# Altium project nRF-TestDevice.PrjPCB (part 1 of 2)
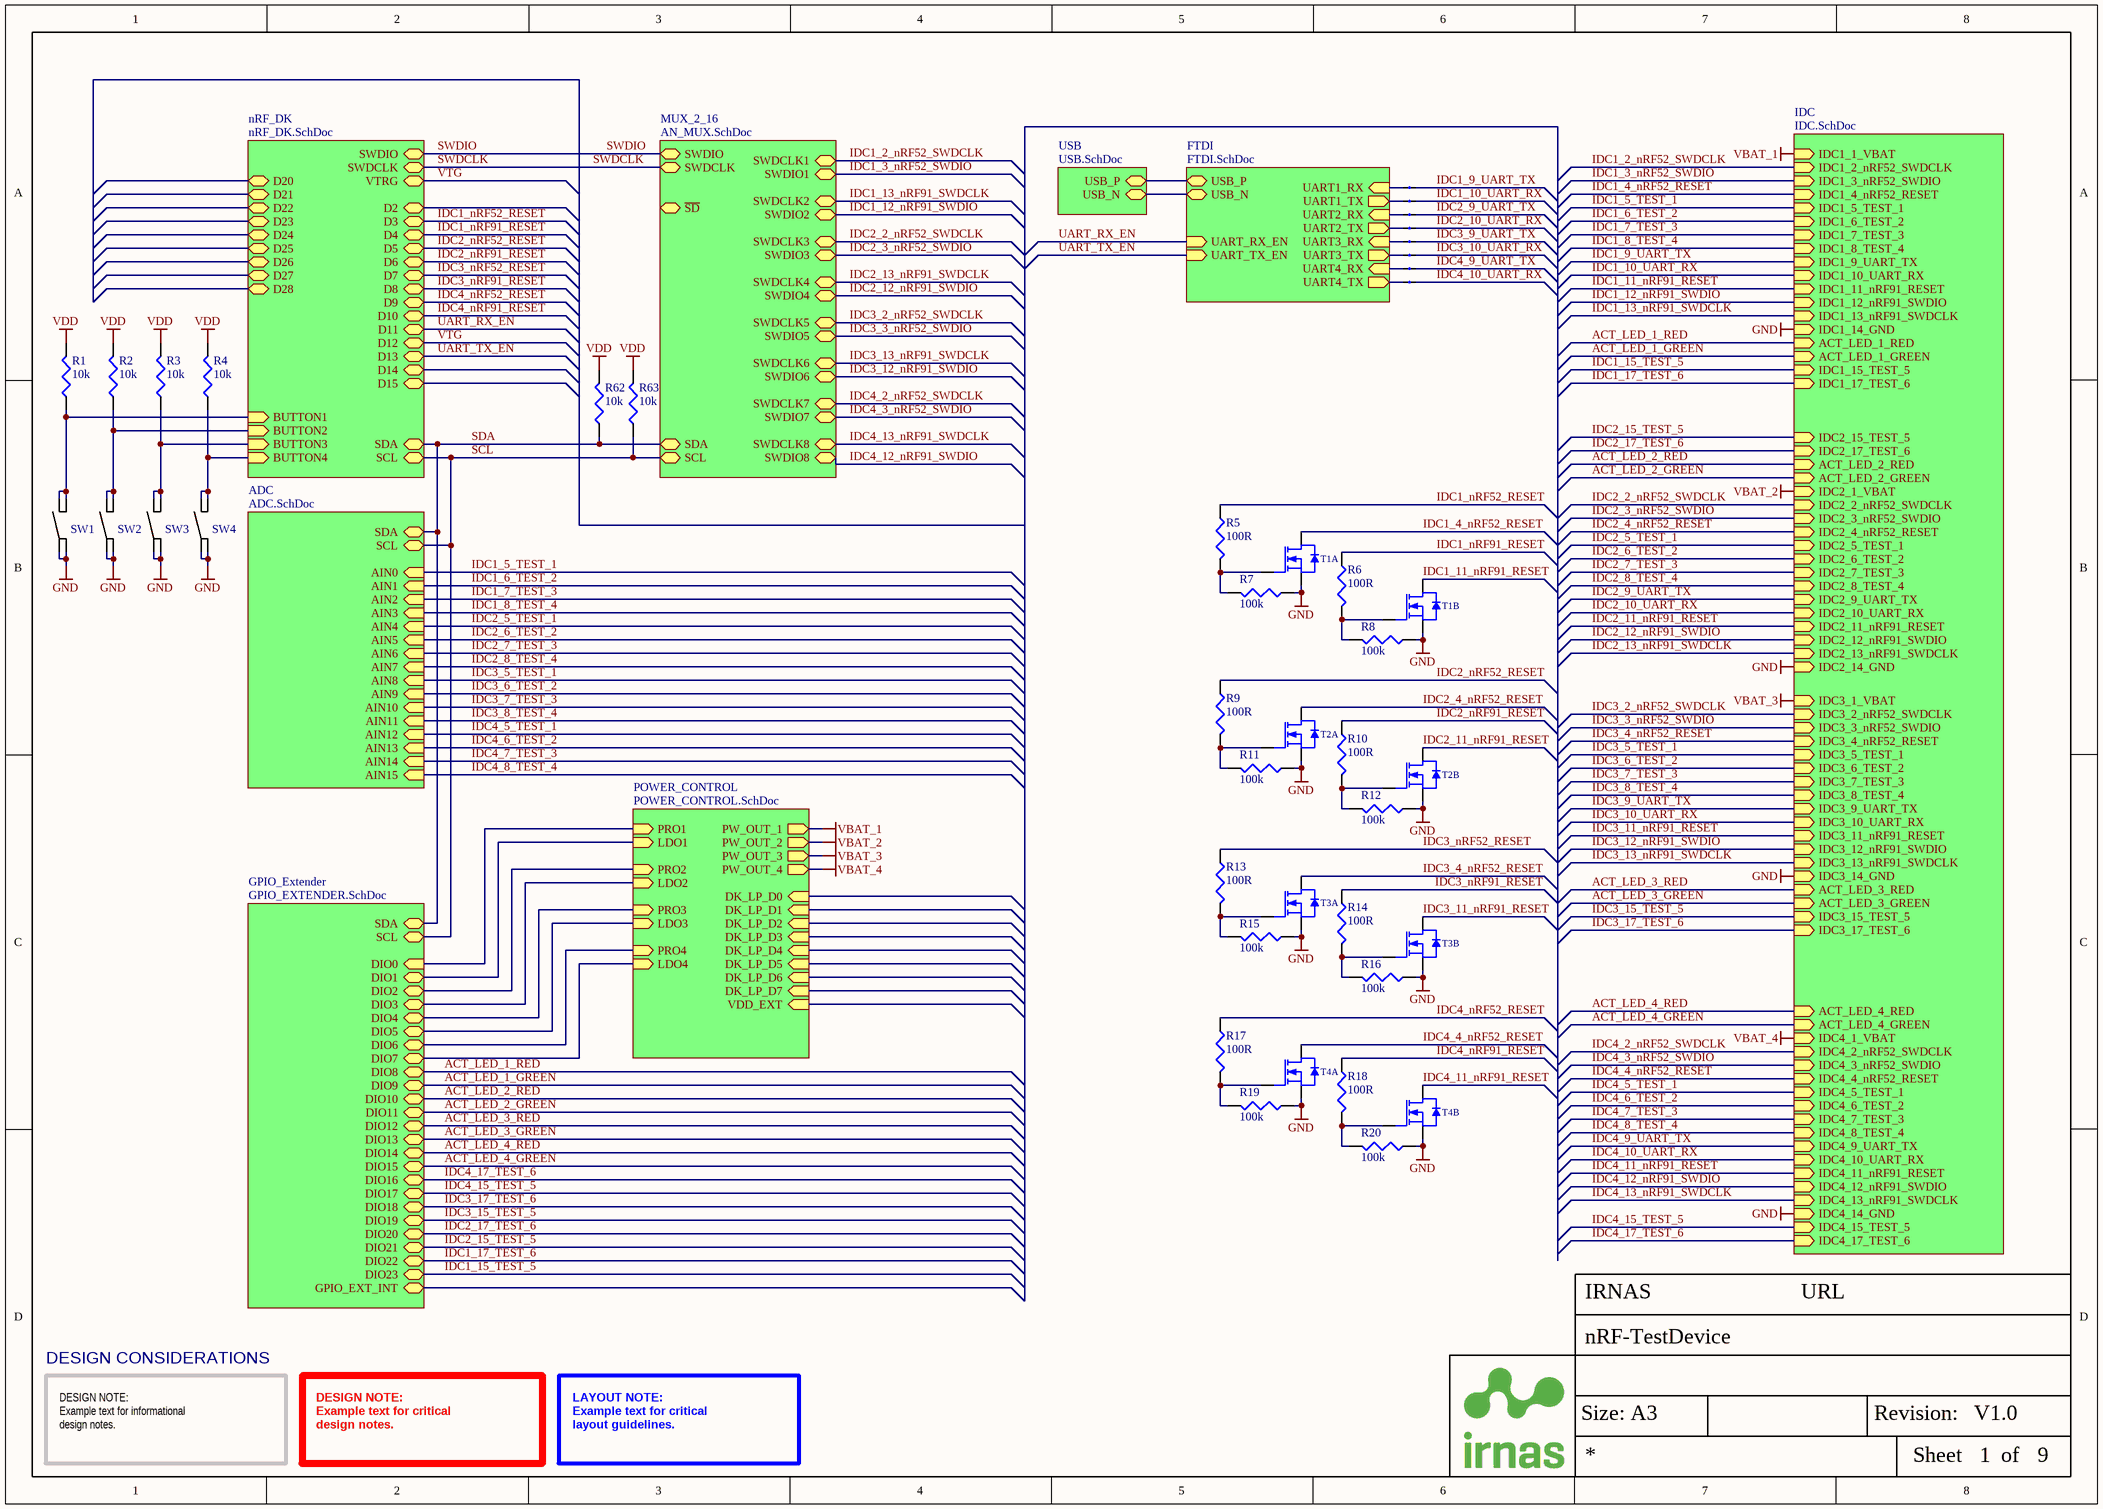
[diagram p0: MAIN.SchDoc]
Company: IRNAS; CreateDate: 11.12.2020; PCBDesigner: Aleksej Cegner; ProjectTitle: nRF-TestDevice; RevisionDate: 24.12.2020; Version: V1.0; Website: URL
9 sheets, 220 parts. Net scope: hierarchical (ports join the sheet entries above them; power ports are global).
Board files: nRF-TestDevice.PcbDoc, nRF-TestDevice_Miror.PcbDoc
Sheets:
  MAIN.SchDoc
    nRF_DK = nRF_DK.SchDoc
    ADC = ADC.SchDoc
    MUX_2_16 = AN_MUX.SchDoc
    GPIO_Extender = GPIO_EXTENDER.SchDoc
    POWER_CONTROL = POWER_CONTROL.SchDoc
    FTDI = FTDI.SchDoc
    IDC = IDC.SchDoc
    USB = USB.SchDoc

## Sheet MAIN.SchDoc
size A3; DocumentNumber: 1; SheetNumber: 1; SheetTotal: 9

### Parts
NT1  (no value)  [2 PIN STARPOINT]  (net tie, no BOM)
NT2  (no value)  [2 PIN STARPOINT]  (net tie, no BOM)
NT3  (no value)  [2 PIN STARPOINT]  (net tie, no BOM)
NT4  (no value)  [2 PIN STARPOINT]  (net tie, no BOM)
NT5  (no value)  [2 PIN STARPOINT]  (net tie, no BOM)
NT6  (no value)  [2 PIN STARPOINT]  (net tie, no BOM)
NT7  (no value)  [2 PIN STARPOINT]  (net tie, no BOM)
NT8  (no value)  [2 PIN STARPOINT]  (net tie, no BOM)
R1  10k  [RES0402]
R2  10k  [RES0402]
R3  10k  [RES0402]
R4  10k  [RES0402]
R5  100R  [RES0402]
R6  100R  [RES0402]
R7  100k  [RES0402]
R8  100k  [RES0402]
R9  100R  [RES0402]
R10  100R  [RES0402]
R11  100k  [RES0402]
R12  100k  [RES0402]
R13  100R  [RES0402]
R14  100R  [RES0402]
R15  100k  [RES0402]
R16  100k  [RES0402]
R17  100R  [RES0402]
R18  100R  [RES0402]
R19  100k  [RES0402]
R20  100k  [RES0402]
R62  10k  [RES0402]
R63  10k  [RES0402]
SW1  PTS645SL50-2 LFS  [Tactile Switch THT]  (value not drawn)
SW2  PTS645SL50-2 LFS  [Tactile Switch THT]  (value not drawn)
SW3  PTS645SL50-2 LFS  [Tactile Switch THT]  (value not drawn)
SW4  PTS645SL50-2 LFS  [Tactile Switch THT]  (value not drawn)
T1  NTZD3154NT1G  [SOT-563]  (value not drawn)  (parts A,B of 2)
T2  NTZD3154NT1G  [SOT-563]  (value not drawn)  (parts A,B of 2)
T3  NTZD3154NT1G  [SOT-563]  (value not drawn)  (parts A,B of 2)
T4  NTZD3154NT1G  [SOT-563]  (value not drawn)  (parts A,B of 2)

### Sub-sheets
ADC = ADC.SchDoc: AIN0 (in), AIN1 (in), AIN2 (in), AIN3 (in), AIN4 (in), AIN5 (in), AIN6 (in), AIN7 (in), SCL (bidir), SDA (bidir), AIN8 (in), AIN9 (in), AIN10 (in), AIN11 (in), AIN12 (in), AIN13 (in), AIN14 (in), AIN15 (in)
FTDI = FTDI.SchDoc: UART1_RX (in), UART1_TX (out), UART2_RX (in), UART2_TX (out), UART3_RX (in), UART3_TX (out), UART4_RX (in), UART4_TX (out), USB_P (bidir), USB_N (bidir), UART_RX_EN (in), UART_TX_EN (in)
GPIO_Extender = GPIO_EXTENDER.SchDoc: DIO1 (bidir), DIO2 (bidir), DIO3 (bidir), DIO4 (bidir), DIO5 (bidir), DIO6 (bidir), DIO7 (bidir), DIO8 (bidir), DIO9 (bidir), DIO10 (bidir), DIO11 (bidir), DIO12 (bidir), DIO13 (bidir), DIO14 (bidir), DIO15 (bidir), SDA (bidir), SCL (bidir), DIO0 (in), DIO17 (bidir), GPIO_EXT_INT (bidir), DIO20 (bidir), DIO22 (bidir), DIO23 (bidir), DIO18 (bidir), DIO16 (bidir), DIO21 (bidir), DIO19 (bidir)
IDC = IDC.SchDoc: IDC1_1_VBAT (in), IDC1_2_nRF52_SWDCLK (in), IDC1_3_nRF52_SWDIO (in), IDC1_4_nRF52_RESET (in), IDC1_5_TEST_1 (in), IDC1_6_TEST_2 (in), IDC1_7_TEST_3 (in), IDC1_8_TEST_4 (in), IDC1_9_UART_TX (in), IDC1_10_UART_RX (in), IDC1_11_nRF91_RESET (in), IDC1_12_nRF91_SWDIO (in), IDC1_13_nRF91_SWDCLK (in), IDC1_14_GND (in), IDC2_1_VBAT (in), IDC2_2_nRF52_SWDCLK (in), IDC2_3_nRF52_SWDIO (in), IDC2_4_nRF52_RESET (in), IDC2_5_TEST_1 (in), IDC2_6_TEST_2 (in), IDC2_7_TEST_3 (in), IDC2_8_TEST_4 (in), IDC2_9_UART_TX (in), IDC2_10_UART_RX (in), IDC2_11_nRF91_RESET (in), IDC2_12_nRF91_SWDIO (in), IDC2_13_nRF91_SWDCLK (in), IDC2_14_GND (in), IDC3_1_VBAT (in), IDC3_2_nRF52_SWDCLK (in), IDC3_3_nRF52_SWDIO (in), IDC3_4_nRF52_RESET (in), IDC3_5_TEST_1 (in), IDC3_6_TEST_2 (in), IDC3_7_TEST_3 (in), IDC3_8_TEST_4 (in), IDC3_9_UART_TX (in), IDC3_10_UART_RX (in), IDC3_11_nRF91_RESET (in), IDC3_12_nRF91_SWDIO (in), IDC3_13_nRF91_SWDCLK (in), IDC3_14_GND (in), IDC4_1_VBAT (in), IDC4_2_nRF52_SWDCLK (in), IDC4_3_nRF52_SWDIO (in), IDC4_4_nRF52_RESET (in), IDC4_5_TEST_1 (in), IDC4_6_TEST_2 (in), IDC4_7_TEST_3 (in), IDC4_8_TEST_4 (in), IDC4_9_UART_TX (in), IDC4_10_UART_RX (in), IDC4_11_nRF91_RESET (in), IDC4_12_nRF91_SWDIO (in), IDC4_13_nRF91_SWDCLK (in), IDC4_14_GND (in), ACT_LED_1_RED (in), ACT_LED_1_GREEN (in), ACT_LED_2_RED (in), ACT_LED_2_GREEN (in), ACT_LED_3_RED (in), ACT_LED_3_GREEN (in), ACT_LED_4_RED (in), ACT_LED_4_GREEN (in), IDC2_17_TEST_6 (in), IDC3_15_TEST_5 (in), IDC3_17_TEST_6 (in), IDC1_17_TEST_6 (in), IDC1_15_TEST_5 (in), IDC4_17_TEST_6 (in), IDC2_15_TEST_5 (in), IDC4_15_TEST_5 (in)
MUX_2_16 = AN_MUX.SchDoc: SWDIO (bidir), SWDCLK (bidir), SWDIO1 (bidir), SWDIO2 (bidir), SWDIO3 (bidir), SWDIO4 (bidir), SWDIO5 (bidir), SWDIO6 (bidir), SWDIO7 (bidir), SWDIO8 (bidir), SWDCLK1 (bidir), SWDCLK2 (bidir), SWDCLK3 (bidir), SWDCLK4 (bidir), SWDCLK5 (bidir), SWDCLK6 (bidir), SWDCLK7 (bidir), SWDCLK8 (bidir), SDA (bidir), SCL (bidir), ~{SD} (bidir)
nRF_DK = nRF_DK.SchDoc: SWDIO (bidir), SWDCLK (bidir), VTRG (bidir), BUTTON1 (in), BUTTON2 (in), BUTTON3 (in), BUTTON4 (in), SDA (bidir), SCL (bidir), D23 (bidir), D25 (bidir), D4 (bidir), D8 (bidir), D15 (bidir), D5 (bidir), D6 (bidir), D21 (bidir), D12 (bidir), D3 (bidir), D27 (bidir), D22 (bidir), D9 (bidir), D11 (bidir), D14 (bidir), D13 (bidir), D2 (bidir), D7 (bidir), D24 (bidir), D26 (bidir), D28 (bidir), D20 (bidir), D10 (bidir)
POWER_CONTROL = POWER_CONTROL.SchDoc: PW_OUT_1 (out), PW_OUT_2 (out), PW_OUT_3 (out), PW_OUT_4 (out), PRO1 (in), LDO1 (in), LDO2 (in), LDO3 (in), LDO4 (in), PRO2 (in), PRO3 (in), PRO4 (in), VDD_EXT (in), DK_LP_D5 (in), DK_LP_D7 (in), DK_LP_D1 (in), DK_LP_D4 (in), DK_LP_D0 (in), DK_LP_D3 (in), DK_LP_D6 (in), DK_LP_D2 (in)
USB = USB.SchDoc: USB_P (bidir), USB_N (bidir)

### Nets
GND: R7.1 R8.1 R11.1 R12.1 R15.1 R16.1 R19.1 R20.1 SW1.1 SW1.2 SW2.1 SW2.2 SW3.1 SW3.2 SW4.1 SW4.2 T1.1(S1) T1.4(S2) T2.1(S1) T2.4(S2) T3.1(S1) T3.4(S2) T4.1(S1) T4.4(S2) ; sheet IDC/IDC1_14_GND, sheet IDC/IDC2_14_GND, sheet IDC/IDC3_14_GND, sheet IDC/IDC4_14_GND
VBAT_1: sheet POWER_CONTROL/PW_OUT_1, sheet IDC/IDC1_1_VBAT
VBAT_2: sheet POWER_CONTROL/PW_OUT_2, sheet IDC/IDC2_1_VBAT
VBAT_3: sheet POWER_CONTROL/PW_OUT_3, sheet IDC/IDC3_1_VBAT
VBAT_4: sheet POWER_CONTROL/PW_OUT_4, sheet IDC/IDC4_1_VBAT
VDD: R1.2 R2.2 R3.2 R4.2 R62.2 R63.2
ACT_LED_1_GREEN: sheet GPIO_Extender/DIO9, sheet IDC/ACT_LED_1_GREEN
ACT_LED_1_RED: sheet GPIO_Extender/DIO8, sheet IDC/ACT_LED_1_RED
ACT_LED_2_GREEN: sheet GPIO_Extender/DIO11, sheet IDC/ACT_LED_2_GREEN
ACT_LED_2_RED: sheet GPIO_Extender/DIO10, sheet IDC/ACT_LED_2_RED
ACT_LED_3_GREEN: sheet GPIO_Extender/DIO13, sheet IDC/ACT_LED_3_GREEN
ACT_LED_3_RED: sheet GPIO_Extender/DIO12, sheet IDC/ACT_LED_3_RED
ACT_LED_4_GREEN: sheet GPIO_Extender/DIO15, sheet IDC/ACT_LED_4_GREEN
ACT_LED_4_RED: sheet GPIO_Extender/DIO14, sheet IDC/ACT_LED_4_RED
DIO0: sheet GPIO_Extender/DIO0, sheet POWER_CONTROL/PRO1
DIO1: sheet GPIO_Extender/DIO1, sheet POWER_CONTROL/LDO1
DIO2: sheet GPIO_Extender/DIO2, sheet POWER_CONTROL/PRO2
DIO3: sheet GPIO_Extender/DIO3, sheet POWER_CONTROL/LDO2
DIO4: sheet GPIO_Extender/DIO4, sheet POWER_CONTROL/PRO3
DIO5: sheet GPIO_Extender/DIO5, sheet POWER_CONTROL/LDO3
DIO6: sheet GPIO_Extender/DIO6, sheet POWER_CONTROL/PRO4
DIO7: sheet GPIO_Extender/DIO7, sheet POWER_CONTROL/LDO4
IDC1_2_nRF52_SWDCLK: sheet MUX_2_16/SWDCLK1, sheet IDC/IDC1_2_nRF52_SWDCLK
IDC1_3_nRF52_SWDIO: sheet MUX_2_16/SWDIO1, sheet IDC/IDC1_3_nRF52_SWDIO
IDC1_4_nRF52_RESET: T1.6(D1) ; sheet IDC/IDC1_4_nRF52_RESET
IDC1_5_TEST_1: sheet ADC/AIN0, sheet IDC/IDC1_5_TEST_1
IDC1_6_TEST_2: sheet ADC/AIN1, sheet IDC/IDC1_6_TEST_2
IDC1_7_TEST_3: sheet ADC/AIN2, sheet IDC/IDC1_7_TEST_3
IDC1_8_TEST_4: sheet ADC/AIN3, sheet IDC/IDC1_8_TEST_4
IDC1_9_UART_TX: NT1.2 ; sheet IDC/IDC1_9_UART_TX
IDC1_10_UART_RX: NT2.2 ; sheet IDC/IDC1_10_UART_RX
IDC1_11_nRF91_RESET: T1.3(D2) ; sheet IDC/IDC1_11_nRF91_RESET
IDC1_12_nRF91_SWDIO: sheet MUX_2_16/SWDIO2, sheet IDC/IDC1_12_nRF91_SWDIO
IDC1_13_nRF91_SWDCLK: sheet MUX_2_16/SWDCLK2, sheet IDC/IDC1_13_nRF91_SWDCLK
IDC1_15_TEST_5: sheet GPIO_Extender/DIO23, sheet IDC/IDC1_15_TEST_5  [project net DIO23]
IDC1_17_TEST_6: sheet GPIO_Extender/DIO22, sheet IDC/IDC1_17_TEST_6  [project net DIO22]
IDC1_nRF52_RESET: R5.1 ; sheet nRF_DK/D3
IDC1_nRF91_RESET: R6.1 ; sheet nRF_DK/D4
IDC2_2_nRF52_SWDCLK: sheet MUX_2_16/SWDCLK3, sheet IDC/IDC2_2_nRF52_SWDCLK
IDC2_3_nRF52_SWDIO: sheet MUX_2_16/SWDIO3, sheet IDC/IDC2_3_nRF52_SWDIO
IDC2_4_nRF52_RESET: T2.6(D1) ; sheet IDC/IDC2_4_nRF52_RESET
IDC2_5_TEST_1: sheet ADC/AIN4, sheet IDC/IDC2_5_TEST_1
IDC2_6_TEST_2: sheet ADC/AIN5, sheet IDC/IDC2_6_TEST_2
IDC2_7_TEST_3: sheet ADC/AIN6, sheet IDC/IDC2_7_TEST_3
IDC2_8_TEST_4: sheet ADC/AIN7, sheet IDC/IDC2_8_TEST_4
IDC2_9_UART_TX: NT3.2 ; sheet IDC/IDC2_9_UART_TX
IDC2_10_UART_RX: NT4.2 ; sheet IDC/IDC2_10_UART_RX
IDC2_11_nRF91_RESET: T2.3(D2) ; sheet IDC/IDC2_11_nRF91_RESET
IDC2_12_nRF91_SWDIO: sheet MUX_2_16/SWDIO4, sheet IDC/IDC2_12_nRF91_SWDIO
IDC2_13_nRF91_SWDCLK: sheet MUX_2_16/SWDCLK4, sheet IDC/IDC2_13_nRF91_SWDCLK
IDC2_15_TEST_5: sheet GPIO_Extender/DIO21, sheet IDC/IDC2_15_TEST_5  [project net DIO21]
IDC2_17_TEST_6: sheet GPIO_Extender/DIO20, sheet IDC/IDC2_17_TEST_6  [project net DIO20]
IDC2_nRF52_RESET: R9.1 ; sheet nRF_DK/D5
IDC2_nRF91_RESET: R10.1 ; sheet nRF_DK/D6
IDC3_2_nRF52_SWDCLK: sheet MUX_2_16/SWDCLK5, sheet IDC/IDC3_2_nRF52_SWDCLK
IDC3_3_nRF52_SWDIO: sheet MUX_2_16/SWDIO5, sheet IDC/IDC3_3_nRF52_SWDIO
IDC3_4_nRF52_RESET: T3.6(D1) ; sheet IDC/IDC3_4_nRF52_RESET
IDC3_5_TEST_1: sheet ADC/AIN8, sheet IDC/IDC3_5_TEST_1
IDC3_6_TEST_2: sheet ADC/AIN9, sheet IDC/IDC3_6_TEST_2
IDC3_7_TEST_3: sheet ADC/AIN10, sheet IDC/IDC3_7_TEST_3
IDC3_8_TEST_4: sheet ADC/AIN11, sheet IDC/IDC3_8_TEST_4
IDC3_9_UART_TX: NT5.2 ; sheet IDC/IDC3_9_UART_TX
IDC3_10_UART_RX: NT6.2 ; sheet IDC/IDC3_10_UART_RX
IDC3_11_nRF91_RESET: T3.3(D2) ; sheet IDC/IDC3_11_nRF91_RESET
IDC3_12_nRF91_SWDIO: sheet MUX_2_16/SWDIO6, sheet IDC/IDC3_12_nRF91_SWDIO
IDC3_13_nRF91_SWDCLK: sheet MUX_2_16/SWDCLK6, sheet IDC/IDC3_13_nRF91_SWDCLK
IDC3_15_TEST_5: sheet GPIO_Extender/DIO19, sheet IDC/IDC3_15_TEST_5  [project net DIO19]
IDC3_17_TEST_6: sheet GPIO_Extender/DIO18, sheet IDC/IDC3_17_TEST_6  [project net DIO18]
IDC3_nRF52_RESET: R13.1 ; sheet nRF_DK/D7
IDC3_nRF91_RESET: R14.1 ; sheet nRF_DK/D8
IDC4_2_nRF52_SWDCLK: sheet MUX_2_16/SWDCLK7, sheet IDC/IDC4_2_nRF52_SWDCLK
IDC4_3_nRF52_SWDIO: sheet MUX_2_16/SWDIO7, sheet IDC/IDC4_3_nRF52_SWDIO
IDC4_4_nRF52_RESET: T4.6(D1) ; sheet IDC/IDC4_4_nRF52_RESET
IDC4_5_TEST_1: sheet ADC/AIN12, sheet IDC/IDC4_5_TEST_1
IDC4_6_TEST_2: sheet ADC/AIN13, sheet IDC/IDC4_6_TEST_2
IDC4_7_TEST_3: sheet ADC/AIN14, sheet IDC/IDC4_7_TEST_3
IDC4_8_TEST_4: sheet ADC/AIN15, sheet IDC/IDC4_8_TEST_4
IDC4_9_UART_TX: NT7.2 ; sheet IDC/IDC4_9_UART_TX
IDC4_10_UART_RX: NT8.2 ; sheet IDC/IDC4_10_UART_RX
IDC4_11_nRF91_RESET: T4.3(D2) ; sheet IDC/IDC4_11_nRF91_RESET
IDC4_12_nRF91_SWDIO: sheet MUX_2_16/SWDIO8, sheet IDC/IDC4_12_nRF91_SWDIO
IDC4_13_nRF91_SWDCLK: sheet MUX_2_16/SWDCLK8, sheet IDC/IDC4_13_nRF91_SWDCLK
IDC4_15_TEST_5: sheet GPIO_Extender/DIO17, sheet IDC/IDC4_15_TEST_5  [project net DIO17]
IDC4_17_TEST_6: sheet GPIO_Extender/DIO16, sheet IDC/IDC4_17_TEST_6  [project net DIO16]
IDC4_nRF52_RESET: R17.1 ; sheet nRF_DK/D9
IDC4_nRF91_RESET: R18.1 ; sheet nRF_DK/D10
P0.16: R1.1 SW1.3 SW1.4 ; sheet nRF_DK/BUTTON1
P0.17: R2.1 SW2.3 SW2.4 ; sheet nRF_DK/BUTTON2
P0.18: R3.1 SW3.3 SW3.4 ; sheet nRF_DK/BUTTON3
P0.19: R4.1 SW4.3 SW4.4 ; sheet nRF_DK/BUTTON4
SCL: R63.1 ; sheet nRF_DK/SCL, sheet ADC/SCL, sheet MUX_2_16/SCL, sheet GPIO_Extender/SCL  [project net P0.31]
SDA: R62.1 ; sheet nRF_DK/SDA, sheet ADC/SDA, sheet MUX_2_16/SDA, sheet GPIO_Extender/SDA  [project net P0.30]
SWDCLK: sheet nRF_DK/SWDCLK, sheet MUX_2_16/SWDCLK
SWDIO: sheet nRF_DK/SWDIO, sheet MUX_2_16/SWDIO
UART1_RX: NT1.1 ; sheet FTDI/UART1_RX
UART1_TX: NT2.1 ; sheet FTDI/UART1_TX
UART2_RX: NT3.1 ; sheet FTDI/UART2_RX
UART2_TX: NT4.1 ; sheet FTDI/UART2_TX
UART3_RX: NT5.1 ; sheet FTDI/UART3_RX
UART3_TX: NT6.1 ; sheet FTDI/UART3_TX
UART4_RX: NT7.1 ; sheet FTDI/UART4_RX
UART4_TX: NT8.1 ; sheet FTDI/UART4_TX
UART_RX_EN: sheet nRF_DK/D11, sheet nRF_DK/D13, sheet FTDI/UART_RX_EN, sheet FTDI/UART_TX_EN  [also labelled UART_TX_EN]  [project net P0.11]
USB_N: sheet FTDI/USB_N, sheet USB/USB_N
USB_P: sheet FTDI/USB_P, sheet USB/USB_P
VTG: sheet nRF_DK/VTRG, sheet nRF_DK/D12  [project net P0.12]
NetR5_2: R5.2 R7.2 T1.2(G1)
NetR6_2: R6.2 R8.2 T1.5(G2)
NetR9_2: R9.2 R11.2 T2.2(G1)
NetR10_2: R10.2 R12.2 T2.5(G2)
NetR13_2: R13.2 R15.2 T3.2(G1)
NetR14_2: R14.2 R16.2 T3.5(G2)
NetR17_2: R17.2 R19.2 T4.2(G1)
NetR18_2: R18.2 R20.2 T4.5(G2)

### Notes on the sheet
- DESIGN CONSIDERATIONS
- DESIGN NOTE:
  Example text for informational
  design notes.
- DESIGN NOTE:
  Example text for critical
  design notes.
- LAYOUT NOTE:
  Example text for critical
  layout guidelines.
- Size: A3
- Revision:
- Sheet
- of

### Library data of the parts
NT1-NT8 = NetTie: Starpoint
R1-R4 R62 R63 = R - 10k/0402: MULTICOMP         MCWR04X1002FTL             SMD Chip Resistor, Thick Film, 10 kohm, 50 V, 0402 [1005 Metric], 62.5 mW,  1%, MCWR Series; IRNAS Part No.: I-100014; Resistance: 10kR; Voltage Rating: 50V; Power Rating: 62.5mW; Temperature Coefficient: 100ppm/°C; Supplier 1: Farnell; Manufacturer: Multicomp; Manufacturer Part Number: MCWR04X1002FTL; Stock 1: 602609; Pricing 1: 10=0.0029, 100=0.0017, 500=0.0012, 2500=0.001, 5000=0.0008 (EUR); Case/Package: 0402; Case Code (Metric): 1005; Case Code (Imperial): 0402; Packaging: Cut Tape; Composition: Thick Film; Tolerance: 1%; Voltage Rating (DC): 50V; REACH SVHC: No SVHC; ComponentLink1URL: http://www.farnell.com/datasheets/1849611.pdf; ComponentLink1Description: http://www.farnell.com/datasheets/1849611.pdf; Supplier Part Number 1: 2447096
R5 R6 R9 R10 R13 R14 R17 R18 = R - 100R/0402: MULTICOMP         MCMR04X1000FTL            SMD Chip Resistor, Ceramic, MCMR Series, 100 ohm, 50 V, 0402 [1005 Metric], 62.5 mW,  1%; IRNAS Part No.: /; Temperature Coefficient: 100ppm/°C; Power Rating: 62.5mW; Voltage Rating: 50V; Supplier 1: Farnell; Manufacturer: Multicomp; Manufacturer Part Number: MCMR04X1000FTL; Stock 1: 62365; Pricing 1: 10=0.0071, 100=0.0042, 500=0.003, 2500=0.0024, 5000=0.0019 (GBP); Case/Package: 0402; Case Code (Metric): 1005; Case Code (Imperial): 0402; Resistance: 100R; Tolerance: 1%; Composition: Ceramic; Packaging: Cut Tape; Voltage Rating (DC): 50V; REACH SVHC: No SVHC; ComponentLink1URL: https://datasheet.ciiva.com/28692/1716705-28692087.pdf; ComponentLink1Description: https://datasheet.ciiva.com/28692/1716705-28692087.pdf; ComponentLink2URL: https://datasheet.ciiva.com/22708/1716705-22708156.pdf; ComponentLink2Description: https://datasheet.ciiva.com/22708/1716705-22708156.pdf; Supplier Part Number 1: 2072515
R7 R8 R11 R12 R15 R16 R19 R20 = R - 100k/0402: MULTICOMP   MCWR04X1003FTL   RES, THICK FILM, 100KOHM, 1%, 0.0625W; IRNAS Part No.: I-100013; Resistance: 100kR; Power Rating: 62.5mW; Voltage Rating: 50V; Temperature Coefficient: 100ppm/°C; Supplier 1: Farnell; Manufacturer: Multicomp; Manufacturer Part Number: MCWR04X1003FTL; Stock 1: 161188; Pricing 1: 10=0.0029, 100=0.0017, 500=0.0012, 2500=0.001, 5000=0.0008 (EUR); Mount: Surface Mount; Case/Package: 0402; Case Code (Metric): 1005; Case Code (Imperial): 0402; Tolerance: 1%; Packaging: Cut Tape; Composition: Thick Film; Voltage Rating (DC): 50V; REACH SVHC: No SVHC; ComponentLink1URL: https://datasheet.ciiva.com/46386/1849611-46386524.pdf; ComponentLink1Description: https://datasheet.ciiva.com/46386/1849611-46386524.pdf; Supplier Part Number 1: 2447094
SW1-SW4 = SW - PTS645SL50-2 LFS: Tactile Switch, PT645 Series, Top Actuated, Through Hole, Round Button, 130 gf, 50mA at 12VDC; Manufacturer: C&K; Number of Circuits: 3; Max Voltage Rating (DC): 24V; Throw Configuration: SPST; Insulation Resistance: 100MR; Manufacturer Part Number: PTS645SL50-2 LFS; Stock 1: 20221; Pricing 1: 5 = 1.32000, 25 = 1.07000, 100 = 0.76000, 150 = 0.68000, 250 = 0.60600, 1000 = 0.51000 (EUR); RoHS: Yes; REACH SVHC: Unknown; Flammability Rating: UL94 V-0; ComponentLink1URL: http://www.farnell.com/datasheets/2789831.pdf?_ga=2.4891187.1885680894.1564390817-1373726713.1554121096&_gac=1.58261848.1562763802.CjwKCAjwmZbpBRAGEiwADrmVXm8xT8OHDZvJe8qZIQyyGmIuiUD-TEITatw0hIdDkyBwIXXCH7oneRoCl7cQAvD_BwE; ComponentLink1Description: Datasheet; Supplier 1: Farnell; Supplier Part Number 1: 2435162
T1-T4 = T_M - NTZD3154NT1G: Dual MOSFET, Dual N Channel, 540 mA, 20 V, 0.4 ohm, 4.5 V, 1 V; ELRAD Id sifra / ELRAD Id No: 597778; Opis / Description: MOSFET BSS123       /N-Channel; Komp / Device: SMD; Value: BSS123; Velikost / Size: SOT23; FIT: 0.44; Author: Ciril Golob; Date: 11.07.2018; ComponentLINK1Description: Datasheet; ComponentLINK2Description: Datasheet www; ComponentLINK1URL: c:\ELRADSVN\Altium_Library\Libraries\Active\Datasheet\BSS123.pdf; ComponentLINK2URL: http://www.onsemi.com/pub/Collateral/BSS123-D.PDF

## Sheet nRF_DK.SchDoc
size A3; DocumentNumber: 2; SheetNumber: 2; SheetTotal: 9
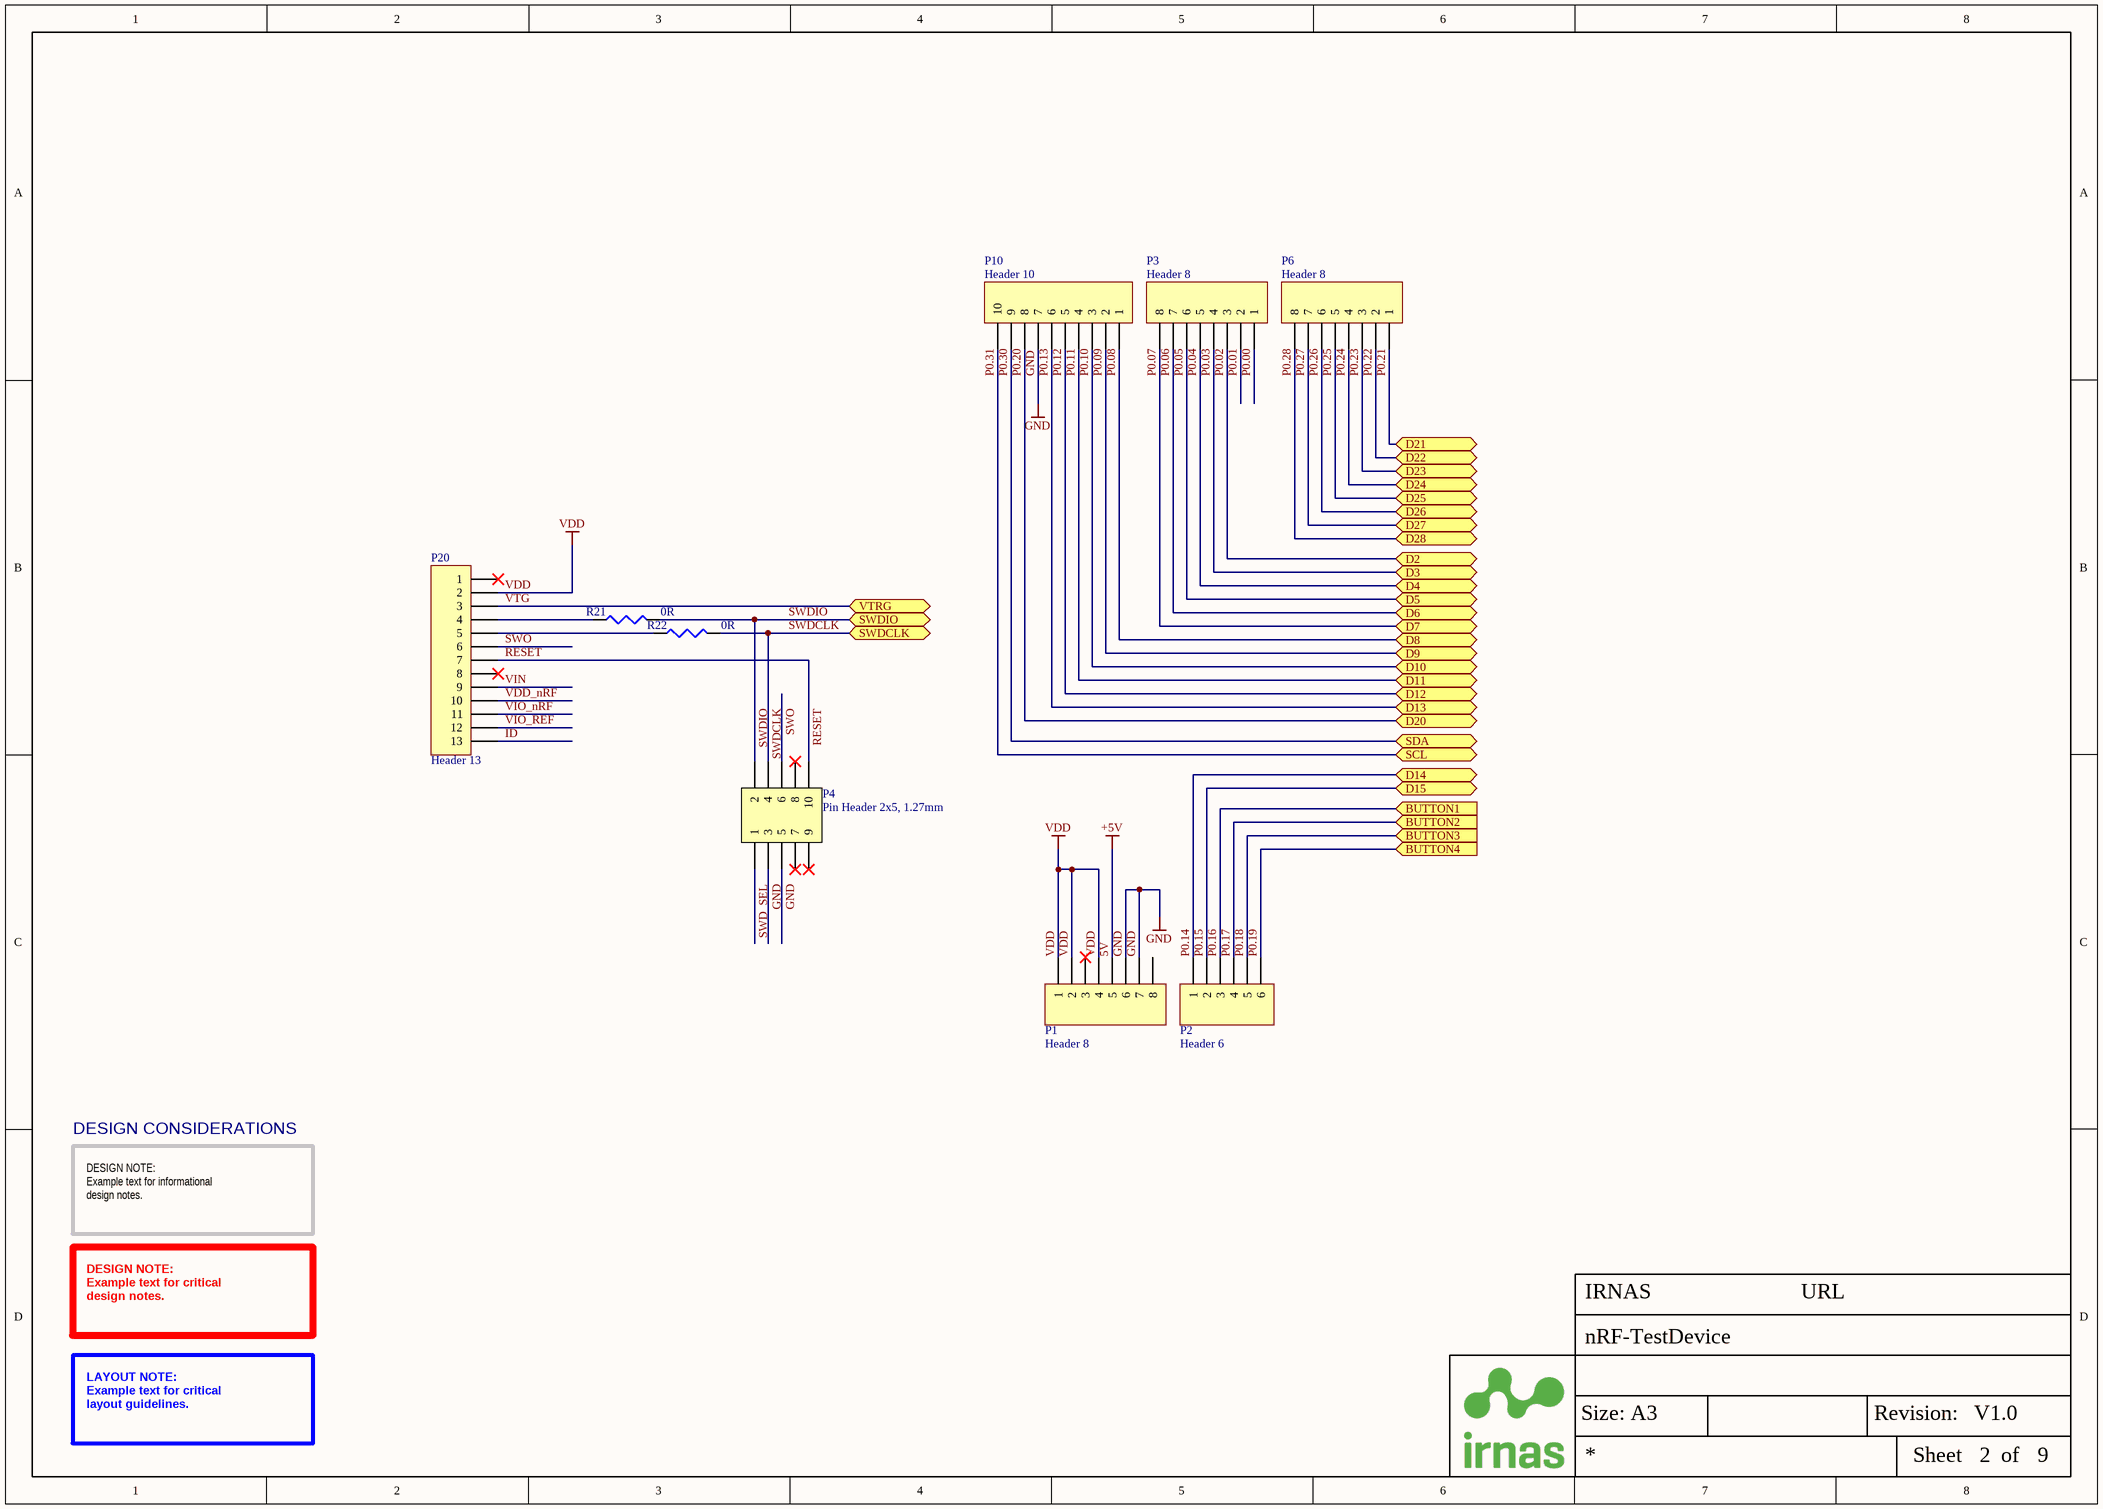
[diagram p1: nRF_DK.SchDoc]

### Parts
P1  Header 8  [HDR1X8]
P2  Header 6  [HDR1X6]
P3  Header 8  [HDR1X8]
P4  Pin Header 2x5, 1.27mm  [HDR_2x5-SMD-1.27mm-K]
P6  Header 8  [HDR1X8]
P10  Header 10  [HDR1X10]
P20  Header 13  [HDR1X13]
R21  0R  [RES0402]
R22  0R  [RES0402]

### Ports
BUTTON1 (in), BUTTON2 (in), BUTTON3 (in), BUTTON4 (in), D2 (bidir), D3 (bidir), D4 (bidir), D5 (bidir), D6 (bidir), D7 (bidir), D8 (bidir), D9 (bidir), D10 (bidir), D11 (bidir), D12 (bidir), D13 (bidir), D14 (bidir), D15 (bidir), D20 (bidir), D21 (bidir), D22 (bidir), D23 (bidir), D24 (bidir), D25 (bidir), D26 (bidir), D27 (bidir), D28 (bidir), SCL (bidir), SDA (bidir), SWDCLK (bidir), SWDIO (bidir), VTRG (bidir)

### Nets
5V: P1.5  [also labelled +5V]
GND: P1.6 P1.7 P4.3 P4.5 P10.7
VDD: P1.1 P1.2 P1.4 P20.2
ID: P20.13
P0.00: P3.1
P0.01: P3.2
P0.02: P3.3 ; port D2
P0.03: P3.4 ; port D3  [project net IDC1_nRF52_RESET]
P0.04: P3.5 ; port D4  [project net IDC1_nRF91_RESET]
P0.05: P3.6 ; port D5  [project net IDC2_nRF52_RESET]
P0.06: P3.7 ; port D6  [project net IDC2_nRF91_RESET]
P0.07: P3.8 ; port D7  [project net IDC3_nRF52_RESET]
P0.08: P10.1 ; port D8  [project net IDC3_nRF91_RESET]
P0.09: P10.2 ; port D9  [project net IDC4_nRF52_RESET]
P0.10: P10.3 ; port D10  [project net IDC4_nRF91_RESET]
P0.11: P10.4 P10.6 ; port D11, port D13  [also labelled P0.13]
P0.12: P10.5 P20.3 ; port VTRG, port D12  [also labelled VTG]
P0.14: P2.1 ; port D14
P0.15: P2.2 ; port D15
P0.16: P2.3 ; port BUTTON1
P0.17: P2.4 ; port BUTTON2
P0.18: P2.5 ; port BUTTON3
P0.19: P2.6 ; port BUTTON4
P0.20: P10.8 ; port D20
P0.21: P6.1 ; port D21
P0.22: P6.2 ; port D22
P0.23: P6.3 ; port D23
P0.24: P6.4 ; port D24
P0.25: P6.5 ; port D25
P0.26: P6.6 ; port D26
P0.27: P6.7 ; port D27
P0.28: P6.8 ; port D28
P0.30: P10.9 ; port SDA
P0.31: P10.10 ; port SCL
RESET: P4.10 P20.7
SWD_SEL: P4.1
SWDCLK: P4.4 R22.2 ; port SWDCLK
SWDIO: P4.2 R21.2 ; port SWDIO
SWO: P4.6 P20.6
VDD_nRF: P20.10
VIN: P20.9
VIO_nRF: P20.11
VIO_REF: P20.12
NetP20_4: P20.4 R21.1
NetP20_5: P20.5 R22.1

Not connected (* = marked no-connect by the designer): P1 3* 8; P4 7* 8* 9*; P20 1* 8*

### Notes on the sheet
- DESIGN CONSIDERATIONS
- DESIGN NOTE:
  Example text for informational
  design notes.
- DESIGN NOTE:
  Example text for critical
  design notes.
- LAYOUT NOTE:
  Example text for critical
  layout guidelines.
- Size: A3
- Revision:
- Sheet
- of

### Library data of the parts
P1 P3 P6 = Header 8: Header, 8-Pin; LatestRevisionDate: 17-Jul-2002; LatestRevisionNote: Re-released for DXP Platform.; Publisher: Altium Limited
P2 = Header 6: Header, 6-Pin; LatestRevisionDate: 17-Jul-2002; LatestRevisionNote: Re-released for DXP Platform.; Publisher: Altium Limited
P4 = CONN-2x5: Pin Header 2x5, 1.27mm (50mil), SMD, Keying Shroud; Part Number: Pin Header 2x5 SMD, 1.27mm, KS; Manufacturer: W-CON; Manufacturer Part Number: 3132-10MS0BK00R1; Part number IPS: 00000009968; Artikkelnr Noca: 55010009; Footprint Doc: HDR_2x5-SMD-1.27mm; LatestRevisionDate: 2016-04-21; Pin Count: 10; Publisher: Nordic Semiconductor; Published: 2016-01-22; Value: Pin Header 2x5, 1.27mm; Note: *; ComponentLink1URL: *; ComponentLink1Description: Datasheet; ComponentLink2URL: *; ComponentLink2Description: Supplier link; HelpURL: \\hizz\pro\app9717\Datasheet\connectores\W-CON\3132-XXMXXBK00XX.pdf; Supplier 1: Cabcon; Supplier Part Number 1: 3132-10MS0BK00R1; Supplier 2: Samtec; Supplier Part Number 2: FTSH-105-01-F-DV-K
P10 = Header 10: Header, 10-Pin; LatestRevisionDate: 17-Jul-2002; LatestRevisionNote: Re-released for DXP Platform.; Publisher: Altium Limited
P20 = Header 13: Header, 13-Pin; LatestRevisionDate: 17-Jul-2002; LatestRevisionNote: Re-released for DXP Platform.; Publisher: Altium Limited
R21 R22 = R - 0R/0402: RESISTOR, 0402, 0R, ANTI SULFURATION; Manufacturer: Multicomp; Manufacturer Part Number: MCMR04X000PTL; IRNAS Part No.: I-100016; Voltage Rating: 50V; Resistance: 0mR; Power Rating: 62.5mW; Temperature Coefficient: 400ppm/°C; Supplier 1: Farnell; Stock 1: 0; Pricing 1: 10=0.0057, 100=0.0034, 500=0.0024, 2500=0.0019, 5000=0.0015 (EUR); Case/Package: 0402; Case Code (Metric): 1005; Case Code (Imperial): 0402; Packaging: Cut Tape; Composition: Ceramic; Voltage Rating (DC): 50V; REACH SVHC: No SVHC; ComponentLink1URL: https://datasheet.ciiva.com/7776/1716705-7776974.pdf; ComponentLink1Description: https://datasheet.ciiva.com/7776/1716705-7776974.pdf; ComponentLink2URL: https://datasheet.ciiva.com/28677/1716705-28677161.pdf; ComponentLink2Description: https://datasheet.ciiva.com/28677/1716705-28677161.pdf; Supplier Part Number 1: 2072513

## Sheet ADC.SchDoc
size A3; DocumentNumber: 6; SheetNumber: 6; SheetTotal: 9
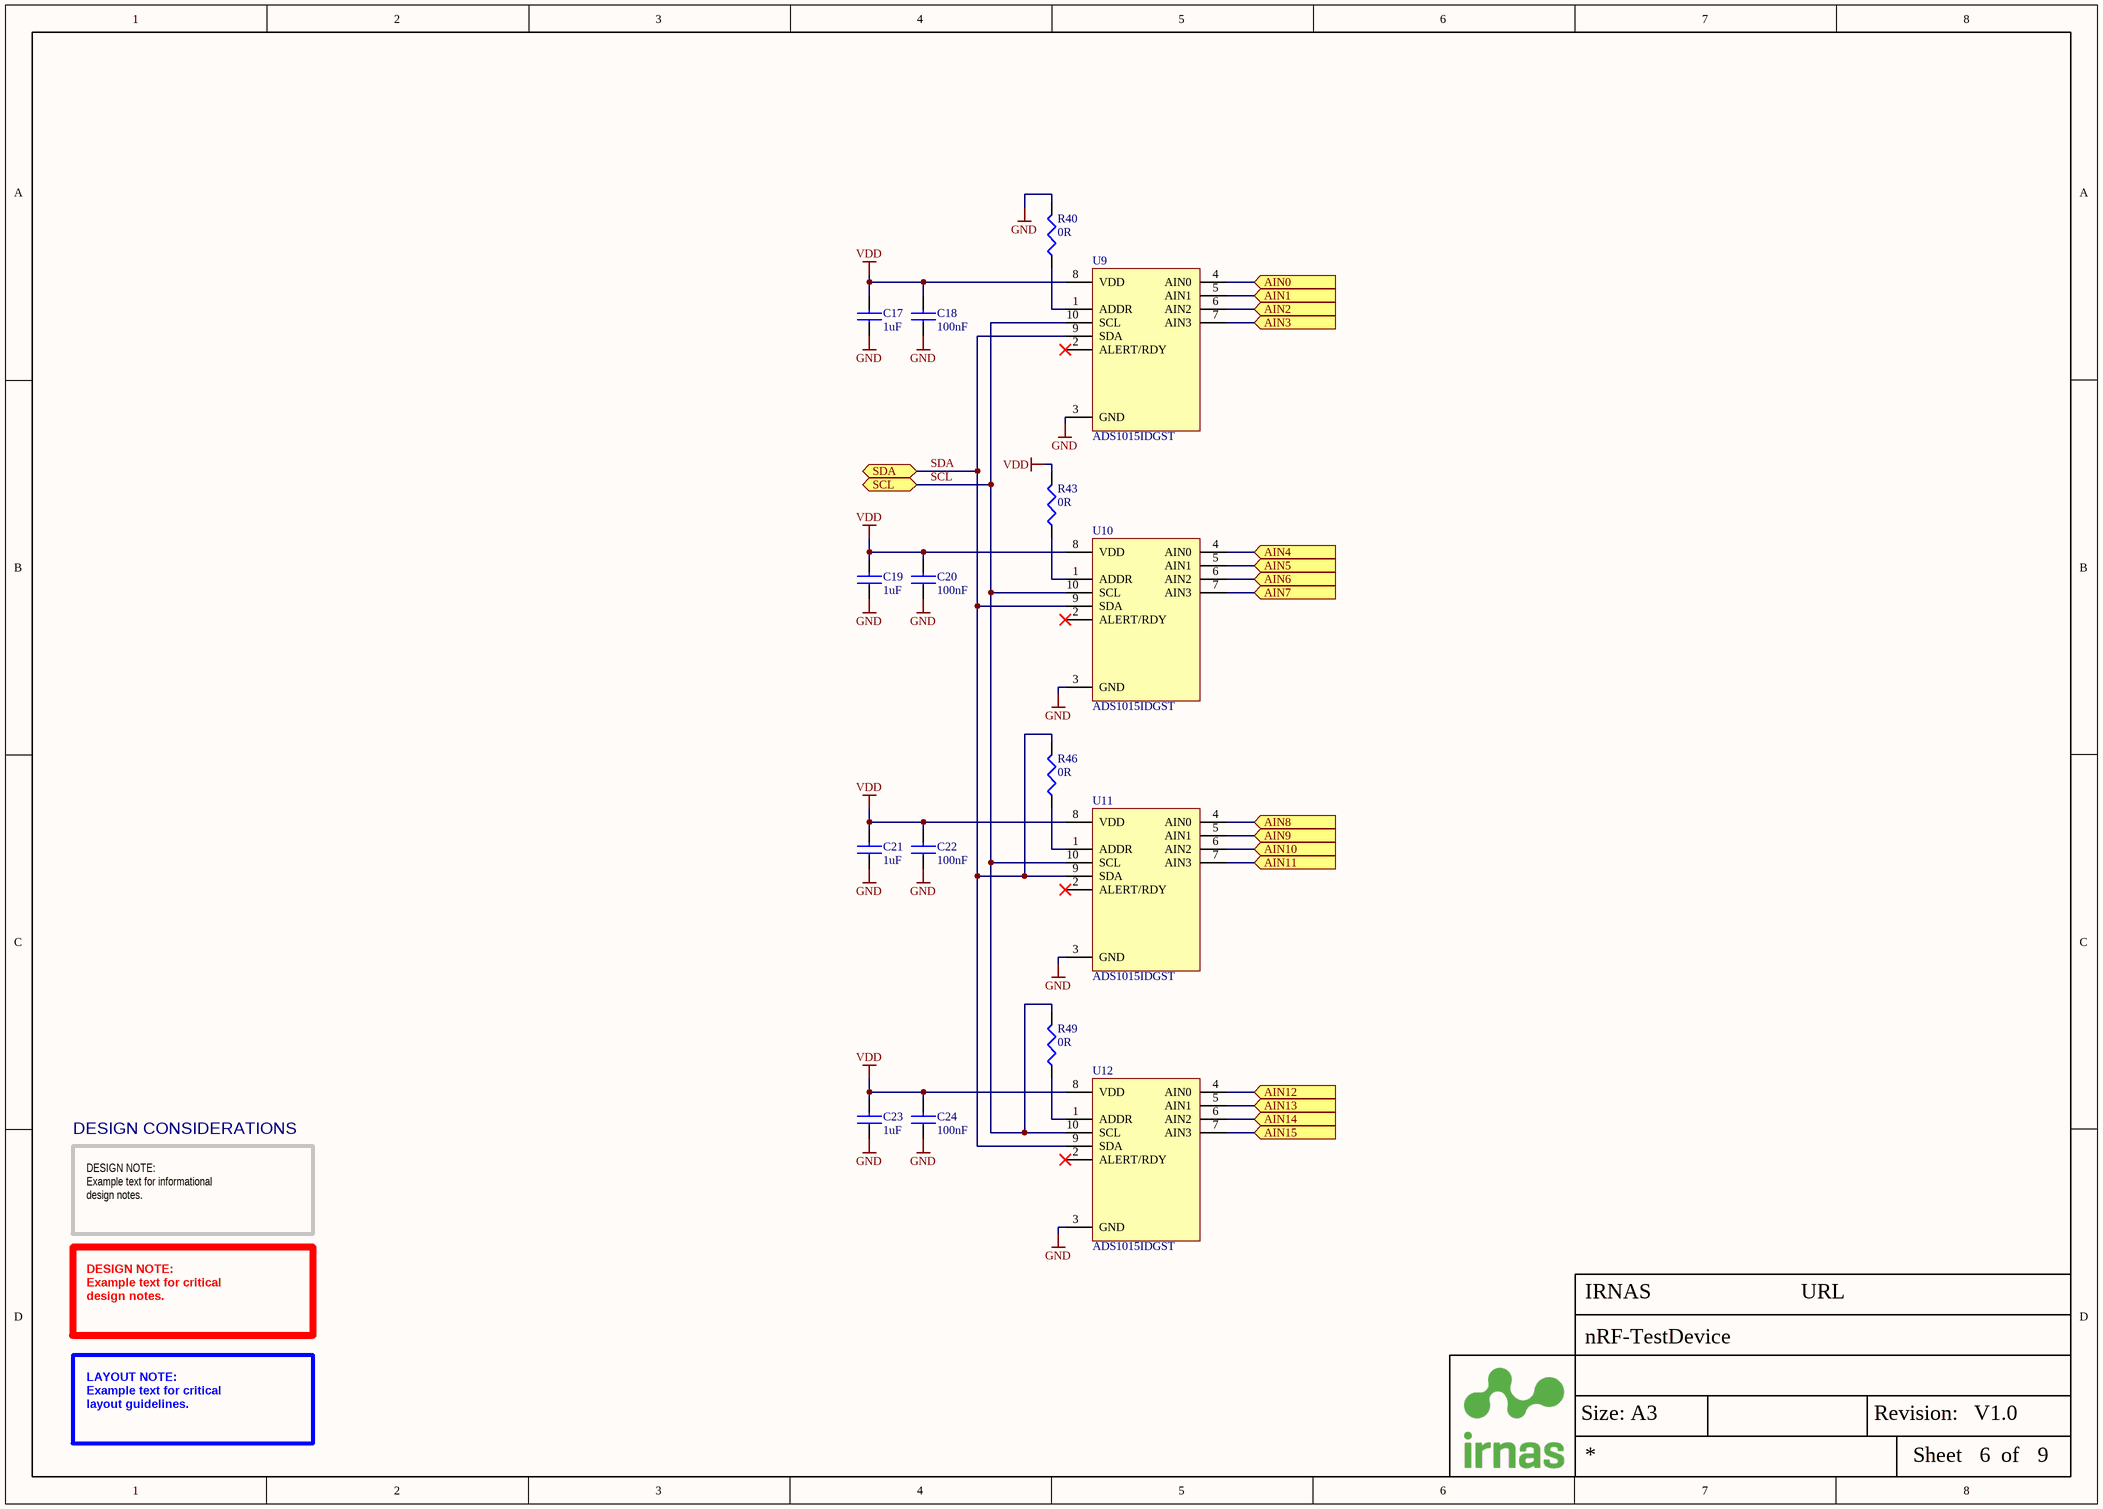
[diagram p2: ADC.SchDoc]

### Parts
C17  1uF  [CAP0402]
C18  100nF  [CAP0402]
C19  1uF  [CAP0402]
C20  100nF  [CAP0402]
C21  1uF  [CAP0402]
C22  100nF  [CAP0402]
C23  1uF  [CAP0402]
C24  100nF  [CAP0402]
R40  0R  [RES0402]
R43  0R  [RES0402]
R46  0R  [RES0402]
R49  0R  [RES0402]
U9  ADS1015IDGST  [VSSOP-10]
U10  ADS1015IDGST  [VSSOP-10]
U11  ADS1015IDGST  [VSSOP-10]
U12  ADS1015IDGST  [VSSOP-10]

### Ports
AIN0 (in), AIN1 (in), AIN2 (in), AIN3 (in), AIN4 (in), AIN5 (in), AIN6 (in), AIN7 (in), AIN8 (in), AIN9 (in), AIN10 (in), AIN11 (in), AIN12 (in), AIN13 (in), AIN14 (in), AIN15 (in), SCL (bidir), SDA (bidir)

### Nets
GND: C17.1 C18.1 C19.1 C20.1 C21.1 C22.1 C23.1 C24.1 R40.2 U9.3(GND) U10.3(GND) U11.3(GND) U12.3(GND)
VDD: C17.2 C18.2 C19.2 C20.2 C21.2 C22.2 C23.2 C24.2 R43.2 U9.8(VDD) U10.8(VDD) U11.8(VDD) U12.8(VDD)
IDC1_5_TEST_1: U9.4(AIN0) ; port AIN0
IDC1_6_TEST_2: U9.5(AIN1) ; port AIN1
IDC1_7_TEST_3: U9.6(AIN2) ; port AIN2
IDC1_8_TEST_4: U9.7(AIN3) ; port AIN3
IDC2_5_TEST_1: U10.4(AIN0) ; port AIN4
IDC2_6_TEST_2: U10.5(AIN1) ; port AIN5
IDC2_7_TEST_3: U10.6(AIN2) ; port AIN6
IDC2_8_TEST_4: U10.7(AIN3) ; port AIN7
IDC3_5_TEST_1: U11.4(AIN0) ; port AIN8
IDC3_6_TEST_2: U11.5(AIN1) ; port AIN9
IDC3_7_TEST_3: U11.6(AIN2) ; port AIN10
IDC3_8_TEST_4: U11.7(AIN3) ; port AIN11
IDC4_5_TEST_1: U12.4(AIN0) ; port AIN12
IDC4_6_TEST_2: U12.5(AIN1) ; port AIN13
IDC4_7_TEST_3: U12.6(AIN2) ; port AIN14
IDC4_8_TEST_4: U12.7(AIN3) ; port AIN15
SCL: R49.2 U9.10(SCL) U10.10(SCL) U11.10(SCL) U12.10(SCL) ; port SCL  [project net P0.31]
SDA: R46.2 U9.9(SDA) U10.9(SDA) U11.9(SDA) U12.9(SDA) ; port SDA  [project net P0.30]
NetR40_1: R40.1 U9.1(ADDR)
NetR43_1: R43.1 U10.1(ADDR)
NetR46_1: R46.1 U11.1(ADDR)
NetR49_1: R49.1 U12.1(ADDR)

Not connected (* = marked no-connect by the designer): U9 2(ALERT/RDY)*; U10 2(ALERT/RDY)*; U11 2(ALERT/RDY)*; U12 2(ALERT/RDY)*

### Notes on the sheet
- DESIGN CONSIDERATIONS
- DESIGN NOTE:
  Example text for informational
  design notes.
- DESIGN NOTE:
  Example text for critical
  design notes.
- LAYOUT NOTE:
  Example text for critical
  layout guidelines.
- Size: A3
- Revision:
- Sheet
- of

### Library data of the parts
C17 C19 C21 C23 = C - 1uF/0402: CAP CER 1UF 10V 20% X5R 0402; Manufacturer: Murata; Manufacturer Part Number: GRM155R61A105ME15D; IRNAS Part No.: /; Supplier 1: Farnell; Stock 1: 0; Pricing 1: 10=0.0379, 100=0.0266, 500=0.0156, 2500=0.0098, 5000=0.0083 (EUR); Mount: Surface Mount; Case/Package: 0402; Case Code (Metric): 1005; Case Code (Imperial): 0402; Min Operating Temperature: -55°C; Max Operating Temperature: 85°C; Capacitance: 1uF; Tolerance: 20%; Voltage Rating: 10V; Packaging: Tape and Reel; Package Quantity: 1; Dielectric: X5R; Voltage: 10V; Voltage Rating (DC): 10V; Length: 1mm; Height: 0.5mm; Width: 0.02inch; Thickness: 0.022inch; Depth: 0.5mm; Radiation Hardening: No; REACH SVHC: No SVHC; Lead Free: Lead Free; ComponentLink1URL: https://datasheet.ciiva.com/164/product-164665.pdf; ComponentLink1Description: https://datasheet.ciiva.com/164/product-164665.pdf; ComponentLink2URL: https://datasheet.ciiva.com/11616/product-11616508.pdf; ComponentLink2Description: https://datasheet.ciiva.com/11616/product-11616508.pdf; ComponentLink3URL: https://datasheet.ciiva.com/46418/1769893-46418047.pdf; ComponentLink3Description: https://datasheet.ciiva.com/46418/1769893-46418047.pdf; ComponentLink4URL: https://datasheet.ciiva.com/164/partnumbering-e-01-164666.pdf; ComponentLink4Description: https://datasheet.ciiva.com/164/partnumbering-e-01-164666.pdf; ComponentLink5URL: https://datasheet.ciiva.com/164/partnumbering-e-01-164667.pdf; ComponentLink5Description: https://datasheet.ciiva.com/164/partnumbering-e-01-164667.pdf; Supplier Part Number 1: 2426953
C18 C20 C22 C24 = C - 100nF/0402: MULTICOMP         MC0402X104J160CT             SMD Multilayer Ceramic Capacitor, 0402 [1005 Metric], 0.1 F, 16 V,  5%, X5R, MC Series                          New; IRNAS Part No.: /; Voltage Rating: 16V; Supplier 1: Farnell; Manufacturer: Multicomp; Manufacturer Part Number: MC0402X104J160CT; Stock 1: 3230; Pricing 1: 10=0.0139, 100=0.0108, 500=0.0076, 2500=0.0051, 5000=0.0038 (EUR); Case Code (Metric): 1005; Case Code (Imperial): 0402; Min Operating Temperature: -55°C; Max Operating Temperature: 85°C; Capacitance: 100nF; Dielectric: X5R; Packaging: Tape and Reel; Tolerance: 5%; Voltage Rating (DC): 16V; REACH SVHC: No SVHC; ComponentLink1URL: http://www.farnell.com/datasheets/2117933.pdf; ComponentLink1Description: http://www.farnell.com/datasheets/2117933.pdf; ComponentLink2URL: http://www.farnell.com/datasheets/2117900.pdf; ComponentLink2Description: http://www.farnell.com/datasheets/2117900.pdf; Supplier Part Number 1: 2627419
R40 R43 R46 R49 = R - 0R/0402: as R21 on sheet nRF_DK; Supplier 1: Farnell; Stock 1: 0; Pricing 1: 10=0.0057, 100=0.0034, 500=0.0024, 2500=0.0019, 5000=0.0015 (EUR); Case/Package: 0402; Case Code (Metric): 1005; Case Code (Imperial): 0402; Packaging: Cut Tape; Composition: Ceramic; Voltage Rating (DC): 50V; REACH SVHC: No SVHC; ComponentLink1URL: https://datasheet.ciiva.com/7776/1716705-7776974.pdf; ComponentLink1Description: https://datasheet.ciiva.com/7776/1716705-7776974.pdf; ComponentLink2URL: https://datasheet.ciiva.com/28677/1716705-28677161.pdf; ComponentLink2Description: https://datasheet.ciiva.com/28677/1716705-28677161.pdf; Supplier Part Number 1: 2072513
U9-U12 = ADC - ADS1015IDGST: Analogue to Digital Converter, 12 bit, 3.3 kSPS, Differential, Single Ended, I2C, Single; Manufacturer: TEXAS INSTRUMENTS; ComponentLink1Description: Datasheet; ComponentLink1URL: https://www.nxp.com/docs/en/data-sheet/PCF8591.pdf; Supplier 1: Farnell; Supplier Part Number 1: 3116553; Manufacturer Part Number: ADS1015IDGST

## Sheet AN_MUX.SchDoc
size A3; DocumentNumber: 7; SheetNumber: 7; SheetTotal: 9
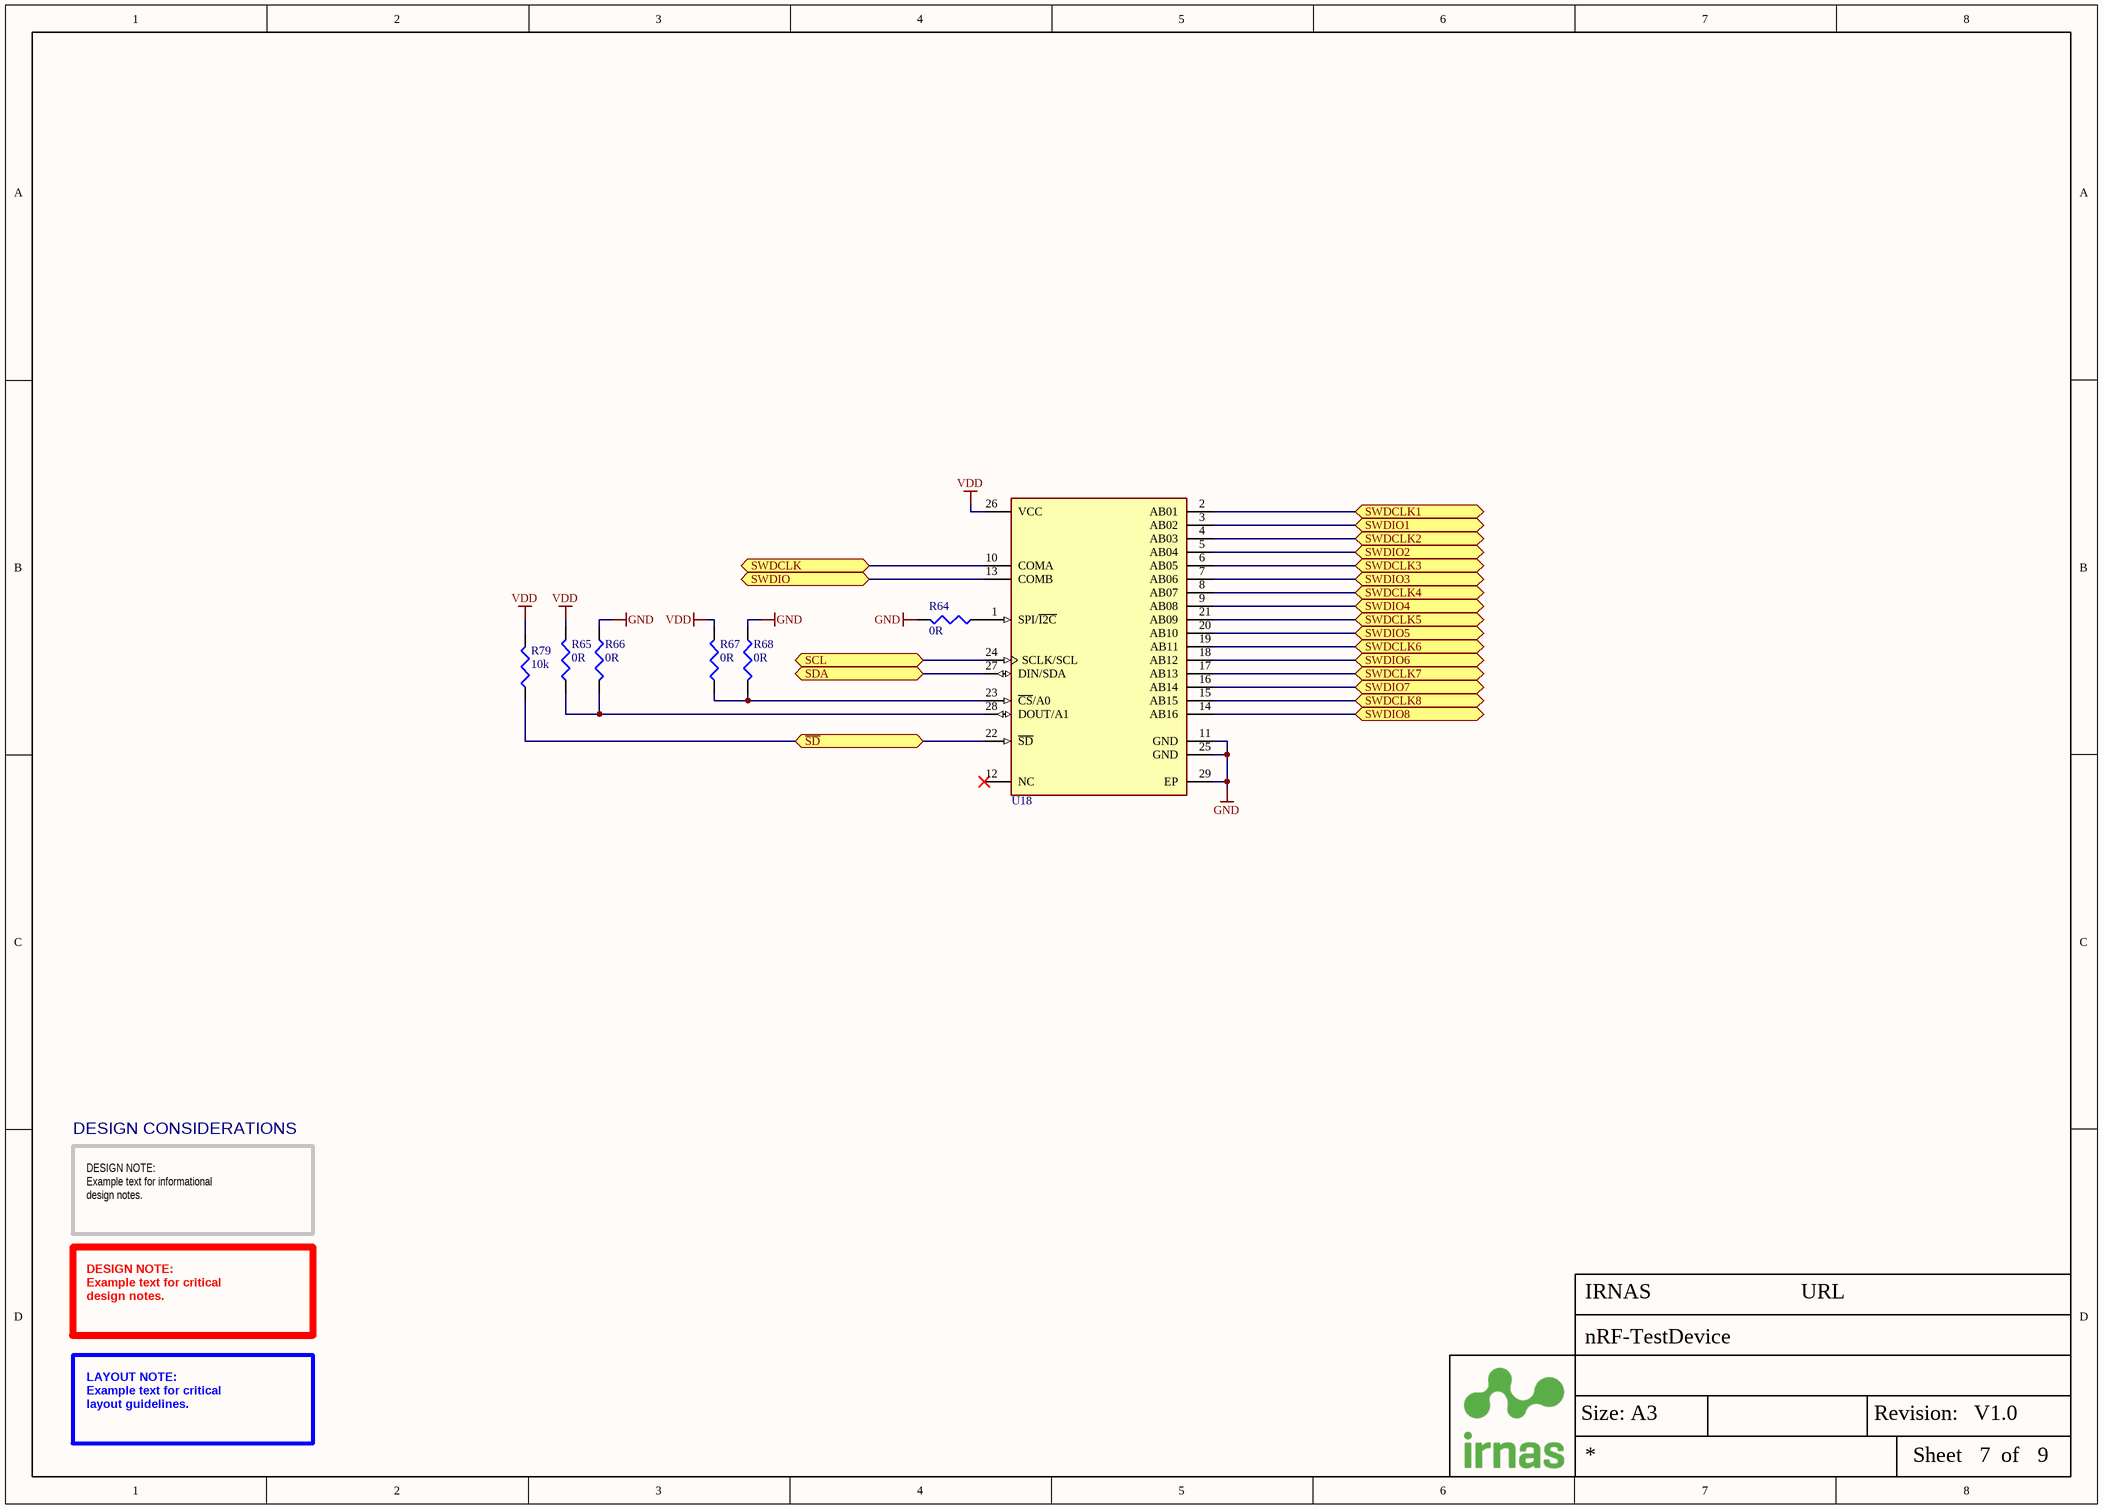
[diagram p3: AN_MUX.SchDoc]

### Parts
R64  0R  [RES0402]
R65  0R  [RES0402]
R66  0R  [RES0402]
R67  0R  [RES0402]
R68  0R  [RES0402]
R79  10k  [RES0402]
U18  INT - MAX14661ETI+  [Maxim_Integrated_T2844-1_IPC_A]  (value not drawn)

### Ports
SCL (bidir), SDA (bidir), SWDCLK1 (bidir), SWDCLK2 (bidir), SWDCLK3 (bidir), SWDCLK4 (bidir), SWDCLK5 (bidir), SWDCLK6 (bidir), SWDCLK7 (bidir), SWDCLK8 (bidir), SWDCLK (bidir), SWDIO1 (bidir), SWDIO2 (bidir), SWDIO3 (bidir), SWDIO4 (bidir), SWDIO5 (bidir), SWDIO6 (bidir), SWDIO7 (bidir), SWDIO8 (bidir), SWDIO (bidir), ~{SD} (bidir)

### Nets
GND: R64.2 R66.1 R68.1 U18.11(GND) U18.25(GND) U18.29(EP)
VDD: R65.2 R67.2 R79.2 U18.26(VCC)
IDC1_2_nRF52_SWDCLK: U18.2(AB01) ; port SWDCLK1
IDC1_3_nRF52_SWDIO: U18.3(AB02) ; port SWDIO1
IDC1_12_nRF91_SWDIO: U18.5(AB04) ; port SWDIO2
IDC1_13_nRF91_SWDCLK: U18.4(AB03) ; port SWDCLK2
IDC2_2_nRF52_SWDCLK: U18.6(AB05) ; port SWDCLK3
IDC2_3_nRF52_SWDIO: U18.7(AB06) ; port SWDIO3
IDC2_12_nRF91_SWDIO: U18.9(AB08) ; port SWDIO4
IDC2_13_nRF91_SWDCLK: U18.8(AB07) ; port SWDCLK4
IDC3_2_nRF52_SWDCLK: U18.21(AB09) ; port SWDCLK5
IDC3_3_nRF52_SWDIO: U18.20(AB10) ; port SWDIO5
IDC3_12_nRF91_SWDIO: U18.18(AB12) ; port SWDIO6
IDC3_13_nRF91_SWDCLK: U18.19(AB11) ; port SWDCLK6
IDC4_2_nRF52_SWDCLK: U18.17(AB13) ; port SWDCLK7
IDC4_3_nRF52_SWDIO: U18.16(AB14) ; port SWDIO7
IDC4_12_nRF91_SWDIO: U18.14(AB16) ; port SWDIO8
IDC4_13_nRF91_SWDCLK: U18.15(AB15) ; port SWDCLK8
P0.30: U18.27(DIN/SDA) ; port SDA
P0.31: U18.24(SCLK/SCL) ; port SCL
~{SD}: R79.1 U18.22(~{SD}) ; port ~{SD}
SWDCLK: U18.10(COMA) ; port SWDCLK
SWDIO: U18.13(COMB) ; port SWDIO
NetR64_1: R64.1 U18.1(SPI/~{I2C})
NetR65_1: R65.1 R66.2 U18.28(DOUT/A1)
NetR67_1: R67.1 R68.2 U18.23(~{CS}/A0)

Not connected (* = marked no-connect by the designer): U18 12(NC)*

### Notes on the sheet
- DESIGN CONSIDERATIONS
- DESIGN NOTE:
  Example text for informational
  design notes.
- DESIGN NOTE:
  Example text for critical
  design notes.
- LAYOUT NOTE:
  Example text for critical
  layout guidelines.
- Size: A3
- Revision:
- Sheet
- of

### Library data of the parts
R64-R68 = R - 0R/0402: as R21 on sheet nRF_DK; Supplier 1: Farnell; Stock 1: 0; Pricing 1: 10=0.0057, 100=0.0034, 500=0.0024, 2500=0.0019, 5000=0.0015 (EUR); Case/Package: 0402; Case Code (Metric): 1005; Case Code (Imperial): 0402; Packaging: Cut Tape; Composition: Ceramic; Voltage Rating (DC): 50V; REACH SVHC: No SVHC; ComponentLink1URL: https://datasheet.ciiva.com/7776/1716705-7776974.pdf; ComponentLink1Description: https://datasheet.ciiva.com/7776/1716705-7776974.pdf; ComponentLink2URL: https://datasheet.ciiva.com/28677/1716705-28677161.pdf; ComponentLink2Description: https://datasheet.ciiva.com/28677/1716705-28677161.pdf; Supplier Part Number 1: 2072513
R79 = R - 10k/0402: as R1 on sheet MAIN; Supplier 1: Farnell; Manufacturer: Multicomp; Manufacturer Part Number: MCWR04X1002FTL; Stock 1: 602609; Pricing 1: 10=0.0029, 100=0.0017, 500=0.0012, 2500=0.001, 5000=0.0008 (EUR); Case/Package: 0402; Case Code (Metric): 1005; Case Code (Imperial): 0402; Packaging: Cut Tape; Composition: Thick Film; Tolerance: 1%; Voltage Rating (DC): 50V; REACH SVHC: No SVHC; ComponentLink1URL: http://www.farnell.com/datasheets/1849611.pdf; ComponentLink1Description: http://www.farnell.com/datasheets/1849611.pdf; Supplier Part Number 1: 2447096

## Sheet GPIO_EXTENDER.SchDoc
size A3; DocumentNumber: 8; SheetNumber: 8; SheetTotal: 9
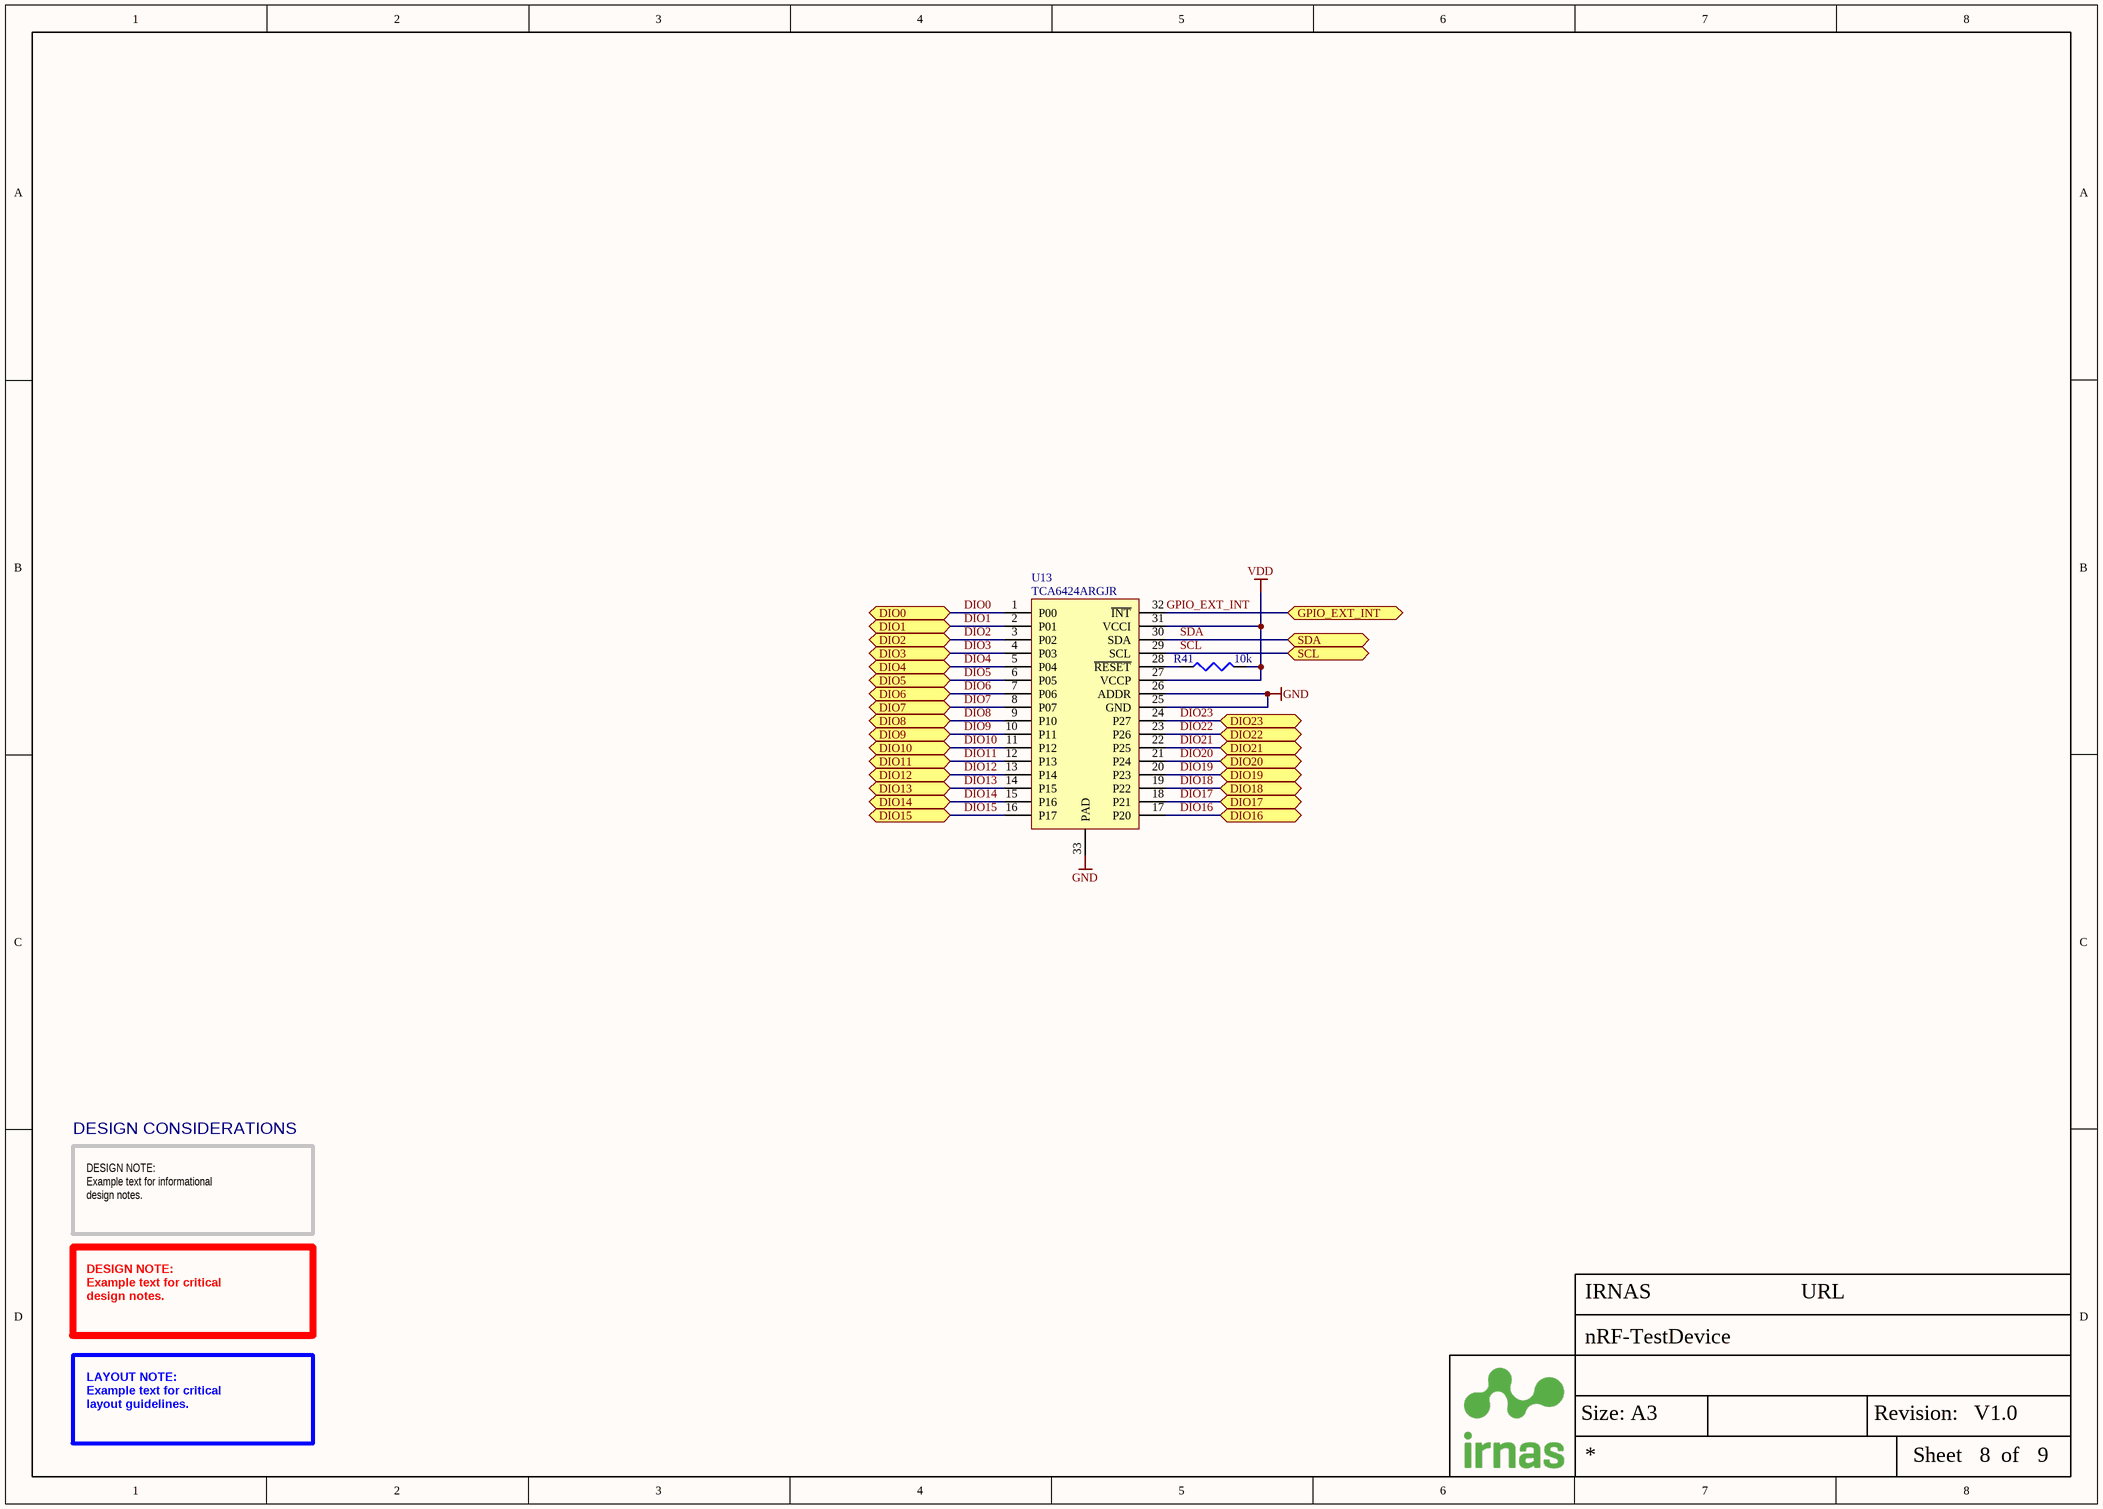
[diagram p4: GPIO_EXTENDER.SchDoc]

### Parts
R41  10k  [RES0402]
U13  TCA6424ARGJR  [UQFN 32]

### Ports
DIO0 (bidir), DIO1 (bidir), DIO2 (bidir), DIO3 (bidir), DIO4 (bidir), DIO5 (bidir), DIO6 (bidir), DIO7 (bidir), DIO8 (bidir), DIO9 (bidir), DIO10 (bidir), DIO11 (bidir), DIO12 (bidir), DIO13 (bidir), DIO14 (bidir), DIO15 (bidir), DIO16 (bidir), DIO17 (bidir), DIO18 (bidir), DIO19 (bidir), DIO20 (bidir), DIO21 (bidir), DIO22 (bidir), DIO23 (bidir), GPIO_EXT_INT (bidir), SCL (bidir), SDA (bidir)

### Nets
GND: U13.25(GND) U13.26(ADDR) U13.33(PAD)
VDD: R41.2 U13.27(VCCP) U13.31(VCCI)
DIO0: U13.1(P00) ; port DIO0
DIO1: U13.2(P01) ; port DIO1
DIO2: U13.3(P02) ; port DIO2
DIO3: U13.4(P03) ; port DIO3
DIO4: U13.5(P04) ; port DIO4
DIO5: U13.6(P05) ; port DIO5
DIO6: U13.7(P06) ; port DIO6
DIO7: U13.8(P07) ; port DIO7
DIO8: U13.9(P10) ; port DIO8  [project net ACT_LED_1_RED]
DIO9: U13.10(P11) ; port DIO9  [project net ACT_LED_1_GREEN]
DIO10: U13.11(P12) ; port DIO10  [project net ACT_LED_2_RED]
DIO11: U13.12(P13) ; port DIO11  [project net ACT_LED_2_GREEN]
DIO12: U13.13(P14) ; port DIO12  [project net ACT_LED_3_RED]
DIO13: U13.14(P15) ; port DIO13  [project net ACT_LED_3_GREEN]
DIO14: U13.15(P16) ; port DIO14  [project net ACT_LED_4_RED]
DIO15: U13.16(P17) ; port DIO15  [project net ACT_LED_4_GREEN]
DIO16: U13.17(P20) ; port DIO16
DIO17: U13.18(P21) ; port DIO17
DIO18: U13.19(P22) ; port DIO18
DIO19: U13.20(P23) ; port DIO19
DIO20: U13.21(P24) ; port DIO20
DIO21: U13.22(P25) ; port DIO21
DIO22: U13.23(P26) ; port DIO22
DIO23: U13.24(P27) ; port DIO23
GPIO_EXT_INT: U13.32(~{INT}) ; port GPIO_EXT_INT
SCL: U13.29(SCL) ; port SCL  [project net P0.31]
SDA: U13.30(SDA) ; port SDA  [project net P0.30]
NetR41_1: R41.1 U13.28(~{RESET})

### Notes on the sheet
- DESIGN CONSIDERATIONS
- DESIGN NOTE:
  Example text for informational
  design notes.
- DESIGN NOTE:
  Example text for critical
  design notes.
- LAYOUT NOTE:
  Example text for critical
  layout guidelines.
- Size: A3
- Revision:
- Sheet
- of

### Library data of the parts
R41 = R - 10k/0402: as R1 on sheet MAIN; Supplier 1: Farnell; Manufacturer: Multicomp; Manufacturer Part Number: MCWR04X1002FTL; Stock 1: 602609; Pricing 1: 10=0.0029, 100=0.0017, 500=0.0012, 2500=0.001, 5000=0.0008 (EUR); Case/Package: 0402; Case Code (Metric): 1005; Case Code (Imperial): 0402; Packaging: Cut Tape; Composition: Thick Film; Tolerance: 1%; Voltage Rating (DC): 50V; REACH SVHC: No SVHC; ComponentLink1URL: http://www.farnell.com/datasheets/1849611.pdf; ComponentLink1Description: http://www.farnell.com/datasheets/1849611.pdf; Supplier Part Number 1: 2447096
U13 = INT - TCA6424ARGJR: I/O Expander, 24bit, 400 kHz, I2C, SMBus, 1.65 V, 5.5 V, UQFN; Supplier 1: Farnell; Supplier Part Number 1: 2308700; ComponentLink1Description: Datasheet; ComponentLink1URL: http://www.ti.com/lit/ds/symlink/tca6424a.pdf

## Sheet POWER_CONTROL.SchDoc
size A3; DocumentNumber: 3; SheetNumber: 3; SheetTotal: 9
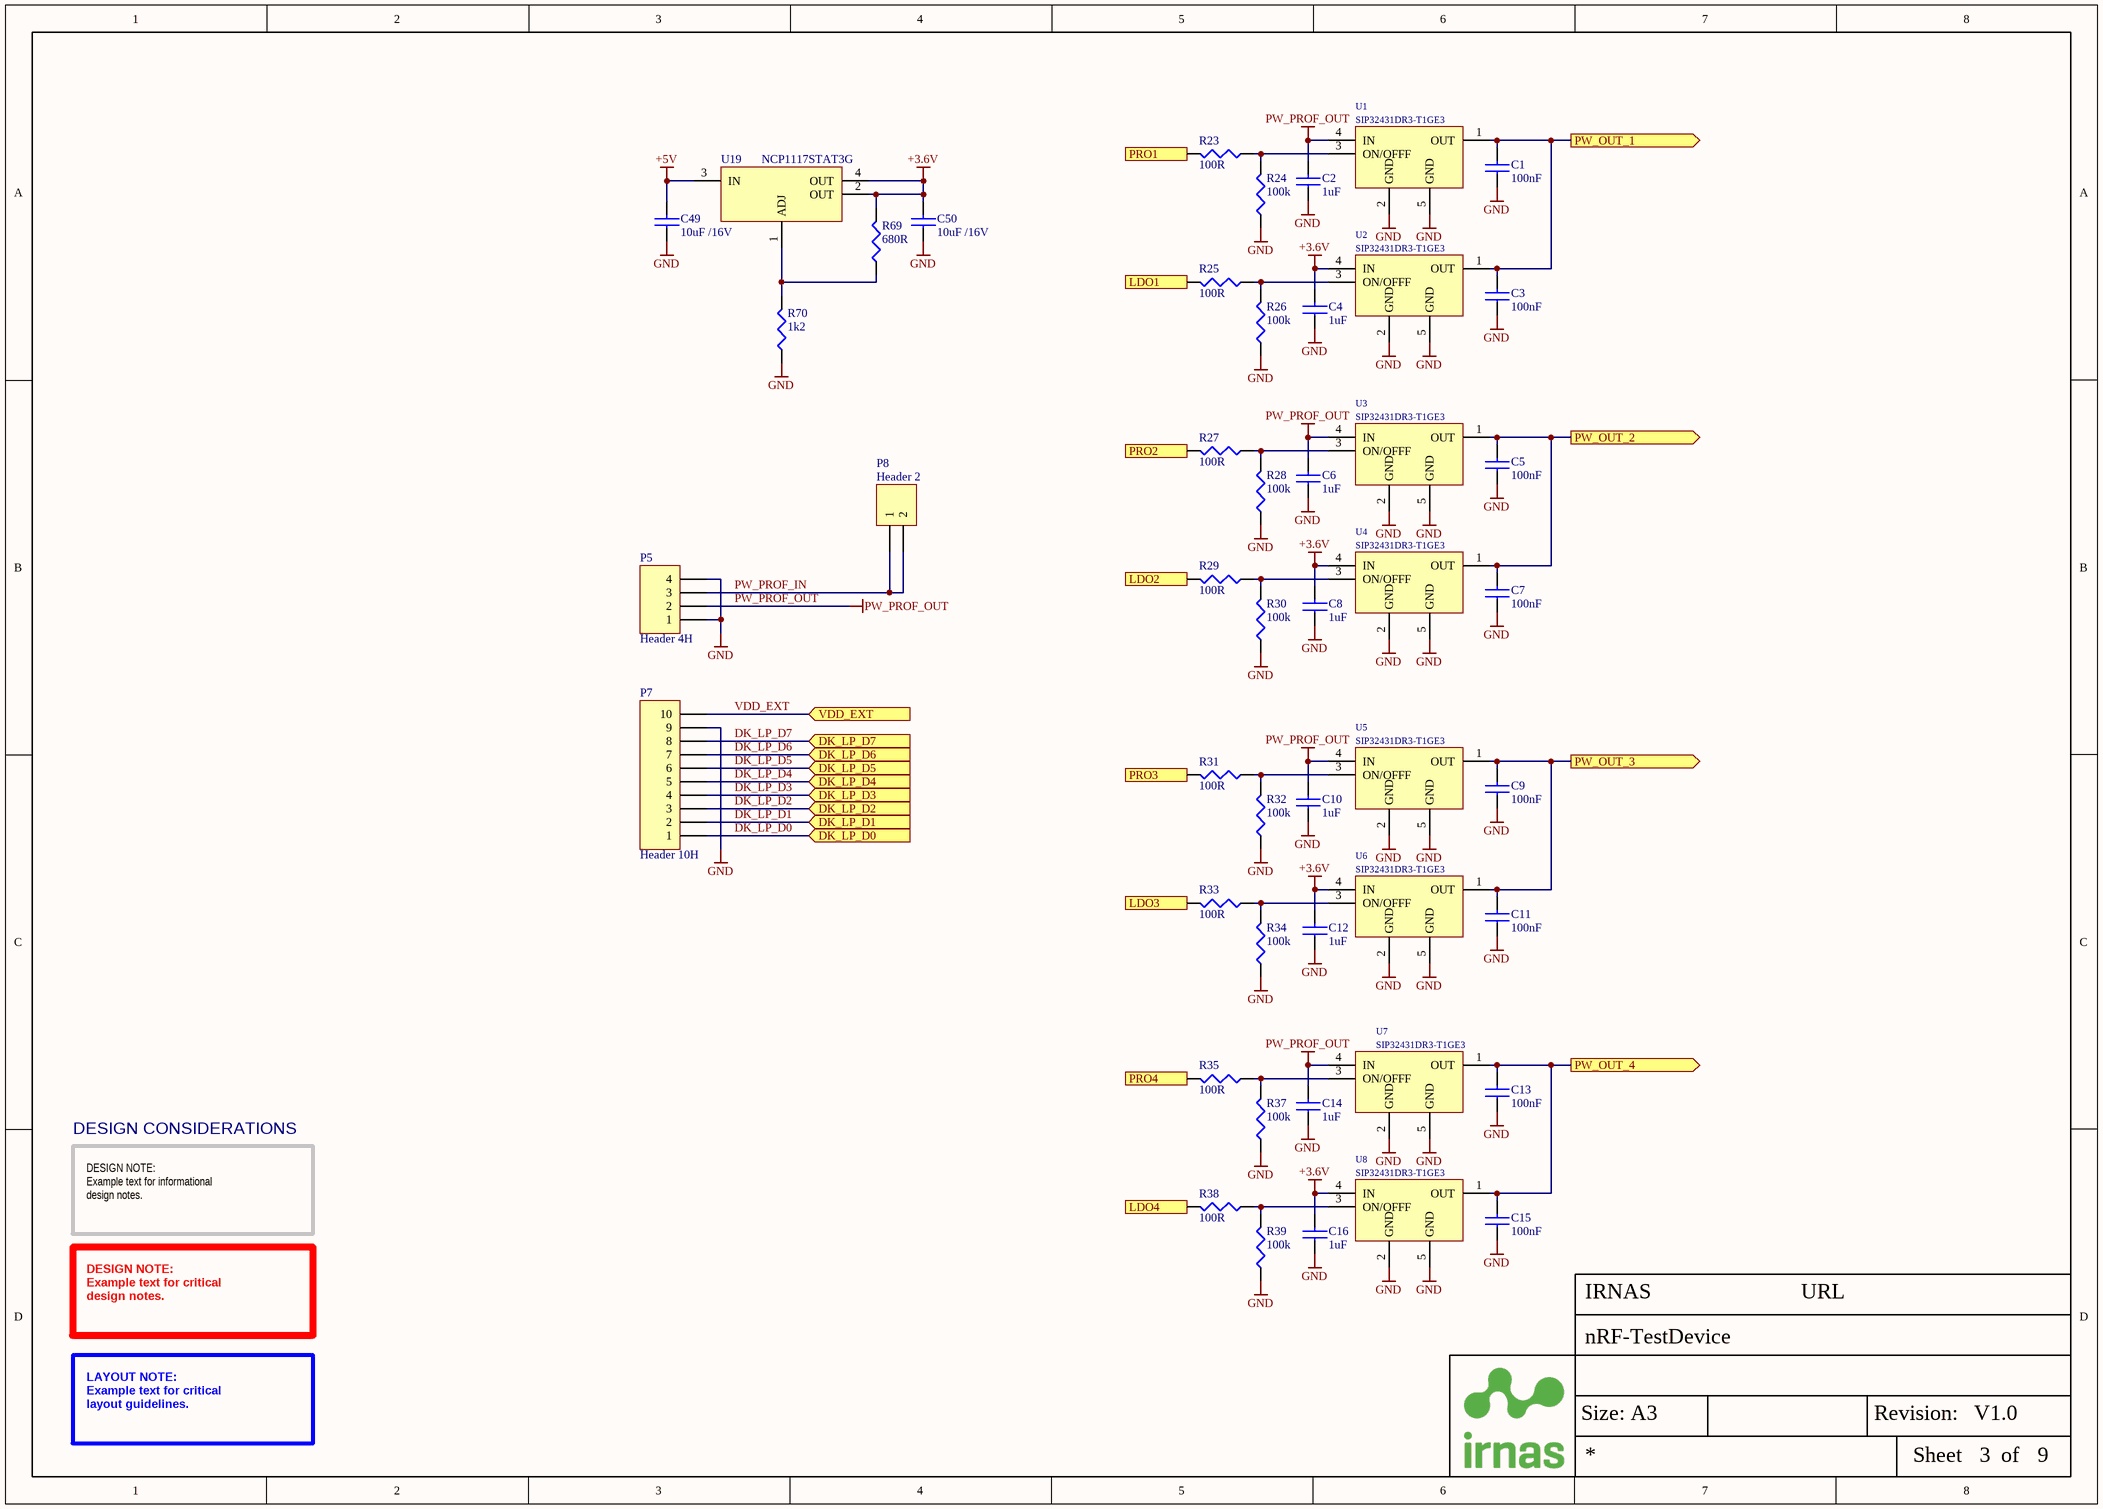
[diagram p5: POWER_CONTROL.SchDoc]

### Parts
C1  100nF  [CAP0402]
C2  1uF  [CAP0402]
C3  100nF  [CAP0402]
C4  1uF  [CAP0402]
C5  100nF  [CAP0402]
C6  1uF  [CAP0402]
C7  100nF  [CAP0402]
C8  1uF  [CAP0402]
C9  100nF  [CAP0402]
C10  1uF  [CAP0402]
C11  100nF  [CAP0402]
C12  1uF  [CAP0402]
C13  100nF  [CAP0402]
C14  1uF  [CAP0402]
C15  100nF  [CAP0402]
C16  1uF  [CAP0402]
C49  10uF /16V  [CAP0805]
C50  10uF /16V  [CAP0805]
P5  Header 4H  [HDR1X4H]
P7  Header 10H  [HDR1X10H]
P8  Header 2  [HDR1X2]
R23  100R  [RES0402]
R24  100k  [RES0402]
R25  100R  [RES0402]
R26  100k  [RES0402]
R27  100R  [RES0402]
R28  100k  [RES0402]
R29  100R  [RES0402]
R30  100k  [RES0402]
R31  100R  [RES0402]
R32  100k  [RES0402]
R33  100R  [RES0402]
R34  100k  [RES0402]
R35  100R  [RES0402]
R37  100k  [RES0402]
R38  100R  [RES0402]
R39  100k  [RES0402]
R69  680R  [RES0402]
R70  1k2  [RES0402]
U1  SIP32431DR3-T1GE3  [SC70-6]
U2  SIP32431DR3-T1GE3  [SC70-6]
U3  SIP32431DR3-T1GE3  [SC70-6]
U4  SIP32431DR3-T1GE3  [SC70-6]
U5  SIP32431DR3-T1GE3  [SC70-6]
U6  SIP32431DR3-T1GE3  [SC70-6]
U7  SIP32431DR3-T1GE3  [SC70-6]
U8  SIP32431DR3-T1GE3  [SC70-6]
U19  NCP1117STAT3G  [SOT223-3]

### Ports
DK_LP_D0 (in), DK_LP_D1 (in), DK_LP_D2 (in), DK_LP_D3 (in), DK_LP_D4 (in), DK_LP_D5 (in), DK_LP_D6 (in), DK_LP_D7 (in), LDO1 (in), LDO2 (in), LDO3 (in), LDO4 (in), PRO1 (in), PRO2 (in), PRO3 (in), PRO4 (in), PW_OUT_1 (out), PW_OUT_2 (out), PW_OUT_3 (out), PW_OUT_4 (out), VDD_EXT (in)

### Nets
+3.6V: C4.2 C8.2 C12.2 C16.2 C50.2 R69.2 U2.4(IN) U4.4(IN) U6.4(IN) U8.4(IN) U19.2(OUT) U19.4(OUT)
+5V: C49.2 U19.3(IN)  [project net 5V]
GND: C1.1 C2.1 C3.1 C4.1 C5.1 C6.1 C7.1 C8.1 C9.1 C10.1 C11.1 C12.1 C13.1 C14.1 C15.1 C16.1 C49.1 C50.1 P5.1 P5.4 P7.9 R24.1 R26.1 R28.1 R30.1 R32.1 R34.1 R37.1 R39.1 R70.1 U1.2(GND) U1.5(GND) U2.2(GND) U2.5(GND) U3.2(GND) U3.5(GND) U4.2(GND) U4.5(GND) U5.2(GND) U5.5(GND) U6.2(GND) U6.5(GND) U7.2(GND) U7.5(GND) U8.2(GND) U8.5(GND)
PW_PROF_OUT: C2.2 C6.2 C10.2 C14.2 P5.2 U1.4(IN) U3.4(IN) U5.4(IN) U7.4(IN)
VBAT_1: C1.2 C3.2 U1.1(OUT) U2.1(OUT) ; port PW_OUT_1
VBAT_2: C5.2 C7.2 U3.1(OUT) U4.1(OUT) ; port PW_OUT_2
VBAT_3: C9.2 C11.2 U5.1(OUT) U6.1(OUT) ; port PW_OUT_3
VBAT_4: C13.2 C15.2 U7.1(OUT) U8.1(OUT) ; port PW_OUT_4
DIO0: R23.2 ; port PRO1
DIO1: R25.2 ; port LDO1
DIO2: R27.2 ; port PRO2
DIO3: R29.2 ; port LDO2
DIO4: R31.2 ; port PRO3
DIO5: R33.2 ; port LDO3
DIO6: R35.2 ; port PRO4
DIO7: R38.2 ; port LDO4
DK_LP_D0: P7.1 ; port DK_LP_D0
DK_LP_D1: P7.2 ; port DK_LP_D1
DK_LP_D2: P7.3 ; port DK_LP_D2
DK_LP_D3: P7.4 ; port DK_LP_D3
DK_LP_D4: P7.5 ; port DK_LP_D4
DK_LP_D5: P7.6 ; port DK_LP_D5
DK_LP_D6: P7.7 ; port DK_LP_D6
DK_LP_D7: P7.8 ; port DK_LP_D7
PW_PROF_IN: P5.3 P8.1 P8.2
VDD_EXT: P7.10 ; port VDD_EXT
NetR23_1: R23.1 R24.2 U1.3(ON/OFFF)
NetR25_1: R25.1 R26.2 U2.3(ON/OFFF)
NetR27_1: R27.1 R28.2 U3.3(ON/OFFF)
NetR29_1: R29.1 R30.2 U4.3(ON/OFFF)
NetR31_1: R31.1 R32.2 U5.3(ON/OFFF)
NetR33_1: R33.1 R34.2 U6.3(ON/OFFF)
NetR35_1: R35.1 R37.2 U7.3(ON/OFFF)
NetR38_1: R38.1 R39.2 U8.3(ON/OFFF)
NetR69_1: R69.1 R70.2 U19.1(ADJ)

### Notes on the sheet
- DESIGN CONSIDERATIONS
- DESIGN NOTE:
  Example text for informational
  design notes.
- DESIGN NOTE:
  Example text for critical
  design notes.
- LAYOUT NOTE:
  Example text for critical
  layout guidelines.
- Size: A3
- Revision:
- Sheet
- of

### Library data of the parts
C1 C3 C5 C7 C9 C11 C13 C15 = C - 100nF/0402: as C18 on sheet ADC; Supplier 1: Farnell; Manufacturer: Multicomp; Manufacturer Part Number: MC0402X104J160CT; Stock 1: 3230; Pricing 1: 10=0.0139, 100=0.0108, 500=0.0076, 2500=0.0051, 5000=0.0038 (EUR); Case Code (Metric): 1005; Case Code (Imperial): 0402; Min Operating Temperature: -55°C; Max Operating Temperature: 85°C; Capacitance: 100nF; Dielectric: X5R; Packaging: Tape and Reel; Tolerance: 5%; Voltage Rating (DC): 16V; REACH SVHC: No SVHC; ComponentLink1URL: http://www.farnell.com/datasheets/2117933.pdf; ComponentLink1Description: http://www.farnell.com/datasheets/2117933.pdf; ComponentLink2URL: http://www.farnell.com/datasheets/2117900.pdf; ComponentLink2Description: http://www.farnell.com/datasheets/2117900.pdf; Supplier Part Number 1: 2627419
C2 C4 C6 C8 C10 C12 C14 C16 = C - 1uF/0402: as C17 on sheet ADC; Supplier 1: Farnell; Stock 1: 0; Pricing 1: 10=0.0379, 100=0.0266, 500=0.0156, 2500=0.0098, 5000=0.0083 (EUR); Mount: Surface Mount; Case/Package: 0402; Case Code (Metric): 1005; Case Code (Imperial): 0402; Min Operating Temperature: -55°C; Max Operating Temperature: 85°C; Capacitance: 1uF; Tolerance: 20%; Voltage Rating: 10V; Packaging: Tape and Reel; Package Quantity: 1; Dielectric: X5R; Voltage: 10V; Voltage Rating (DC): 10V; Length: 1mm; Height: 0.5mm; Width: 0.02inch; Thickness: 0.022inch; Depth: 0.5mm; Radiation Hardening: No; REACH SVHC: No SVHC; Lead Free: Lead Free; ComponentLink1URL: https://datasheet.ciiva.com/164/product-164665.pdf; ComponentLink1Description: https://datasheet.ciiva.com/164/product-164665.pdf; ComponentLink2URL: https://datasheet.ciiva.com/11616/product-11616508.pdf; ComponentLink2Description: https://datasheet.ciiva.com/11616/product-11616508.pdf; ComponentLink3URL: https://datasheet.ciiva.com/46418/1769893-46418047.pdf; ComponentLink3Description: https://datasheet.ciiva.com/46418/1769893-46418047.pdf; ComponentLink4URL: https://datasheet.ciiva.com/164/partnumbering-e-01-164666.pdf; ComponentLink4Description: https://datasheet.ciiva.com/164/partnumbering-e-01-164666.pdf; ComponentLink5URL: https://datasheet.ciiva.com/164/partnumbering-e-01-164667.pdf; ComponentLink5Description: https://datasheet.ciiva.com/164/partnumbering-e-01-164667.pdf; Supplier Part Number 1: 2426953
C49 C50 = C - 10uF /16V: TDK - CGA4J1X5R1C106K125AC - CAP, MLCC, X5R, 10UF, 16V, 0805; IRNAS Part No.: I-200007; Supplier 1: Farnell; Manufacturer: TDK; Manufacturer Part Number: CGA4J1X5R1C106K125AC; RoHS: YES; Stock 1: 8974; Pricing 1: 5=0.41, 50=0.146, 250=0.131, 500=0.12, 1000=0.103 (GBP); ComponentLink1URL: http://bcove.me/e1v54mtm; ComponentLink1Description: http://bcove.me/e1v54mtm; ComponentLink2URL: http://www.farnell.com/datasheets/1936565.pdf; ComponentLink2Description: http://www.farnell.com/datasheets/1936565.pdf; ComponentLink3URL: http://www.farnell.com/datasheets/1683658.pdf; ComponentLink3Description: http://www.farnell.com/datasheets/1683658.pdf; Supplier Part Number 1: 2210948RL; Capacitance: 10uF; Case/Package: 0805; Case Code (Imperial): 0805
P5 = Header 4H: Header, 4-Pin, Right Angle; LatestRevisionDate: 17-Jul-2002; LatestRevisionNote: Re-released for DXP Platform.; Publisher: Altium Limited
P7 = Header 10H: Header, 10-Pin, Right Angle; LatestRevisionDate: 17-Jul-2002; LatestRevisionNote: Re-released for DXP Platform.; Publisher: Altium Limited
P8 = Header 2: Header, 2-Pin; LatestRevisionDate: 17-Jul-2002; LatestRevisionNote: Re-released for DXP Platform.; Publisher: Altium Limited
R23 R25 R27 R29 R31 R33 R35 R38 = R - 100R/0402: as R5 on sheet MAIN; Supplier 1: Farnell; Manufacturer: Multicomp; Manufacturer Part Number: MCMR04X1000FTL; Stock 1: 62365; Pricing 1: 10=0.0071, 100=0.0042, 500=0.003, 2500=0.0024, 5000=0.0019 (GBP); Case/Package: 0402; Case Code (Metric): 1005; Case Code (Imperial): 0402; Resistance: 100R; Tolerance: 1%; Composition: Ceramic; Packaging: Cut Tape; Voltage Rating (DC): 50V; REACH SVHC: No SVHC; ComponentLink1URL: https://datasheet.ciiva.com/28692/1716705-28692087.pdf; ComponentLink1Description: https://datasheet.ciiva.com/28692/1716705-28692087.pdf; ComponentLink2URL: https://datasheet.ciiva.com/22708/1716705-22708156.pdf; ComponentLink2Description: https://datasheet.ciiva.com/22708/1716705-22708156.pdf; Supplier Part Number 1: 2072515
R24 R26 R28 R30 R32 R34 R37 R39 = R - 100k/0402: as R7 on sheet MAIN; Supplier 1: Farnell; Manufacturer: Multicomp; Manufacturer Part Number: MCWR04X1003FTL; Stock 1: 161188; Pricing 1: 10=0.0029, 100=0.0017, 500=0.0012, 2500=0.001, 5000=0.0008 (EUR); Mount: Surface Mount; Case/Package: 0402; Case Code (Metric): 1005; Case Code (Imperial): 0402; Tolerance: 1%; Packaging: Cut Tape; Composition: Thick Film; Voltage Rating (DC): 50V; REACH SVHC: No SVHC; ComponentLink1URL: https://datasheet.ciiva.com/46386/1849611-46386524.pdf; ComponentLink1Description: https://datasheet.ciiva.com/46386/1849611-46386524.pdf; Supplier Part Number 1: 2447094
R69 = R - 680R/0402: RES 680 ohm, ± 1%, 63 mW, 0402; Manufacturer: Vishay; Manufacturer Part Number: CRCW0402680RFKED; IRNAS Part No.: /; Resistance: 510R; Power Rating: 63mW; Voltage Rating: 50V; Temperature Coefficient: 100ppm/°C; Supplier 1: Farnell; Stock 1: 0; Case/Package: 0402; Weight: 2.3E-05oz; Case Code (Imperial): 0402; Case Code (Metric): 1005; Min Operating Temperature: -55°C; Max Operating Temperature: 155°C; Packaging: Tape and Reel; Package Quantity: 1; Termination: SMD/SMT; Tolerance: 1%; Composition: Thick Film; Number of Terminations: 2; Military Standard: Not; Max Power Dissipation: 63mW; Voltage Rating (DC): 50V; Length: 1mm; Height: 0.016inch; Width: 0.5mm; Depth: 0.5mm; REACH SVHC: Unknown; Lead Free: Lead Free; ComponentLink1URL: https://datasheet.ciiva.com/2453/pyu-r-int-thick-7-2453397.pdf; ComponentLink1Description: https://datasheet.ciiva.com/2453/pyu-r-int-thick-7-2453397.pdf; ComponentLink2URL: https://datasheet.ciiva.com/2453/pyu-r-int-thick-7-2453398.pdf; ComponentLink2Description: https://datasheet.ciiva.com/2453/pyu-r-int-thick-7-2453398.pdf; ComponentLink3URL: https://datasheet.ciiva.com/17063/pyu-rc0402-51-rohs-l-6-r-17063430.pdf; ComponentLink3Description: https://datasheet.ciiva.com/17063/pyu-rc0402-51-rohs-l-6-r-17063430.pdf; ComponentLink4URL: https://datasheet.ciiva.com/2453/pyu-r-int-thick-7-2453399.pdf; ComponentLink4Description: https://datasheet.ciiva.com/2453/pyu-r-int-thick-7-2453399.pdf; Supplier Part Number 1: 2140759
R70 = R - 1k2/0402: RES SMD 1.2K OHM 1% 1/16W 0402; Manufacturer: Vishay; Manufacturer Part Number: CRCW04021K20FKED; IRNAS Part No.: /; Power Rating: 63mW; Resistance: 1.2kR; Voltage Rating: 50V; Temperature Coefficient: 100ppm/°C; Supplier 1: Farnell; Stock 1: 3170; Pricing 1: 10=0.0072, 400=0.0053, 1000=0.0043, 2500=0.0041, 5000=0.004 (GBP); Case/Package: 0402; Weight: 2.3E-05oz; Case Code (Metric): 1005; Case Code (Imperial): 0402; Contact Plating: Tin; Min Operating Temperature: -55°C; Max Operating Temperature: 155°C; Composition: Thick Film; Tolerance: 1%; Packaging: Tape and Reel; Package Quantity: 10; Number of Terminations: 2; Military Standard: Not; Termination: SMD/SMT; Max Power Dissipation: 63mW; Voltage Rating (DC): 50V; Length: 1mm; Height: 0.35mm; Width: 0.02inch; Depth: 0.5mm; Radiation Hardening: No; REACH SVHC: Unknown; Lead Free: Lead Free; ComponentLink1URL: https://datasheet.ciiva.com/11811/0900766b80d98824-11811101.pdf; ComponentLink1Description: https://datasheet.ciiva.com/11811/0900766b80d98824-11811101.pdf; ComponentLink2URL: https://datasheet.ciiva.com/3256/dcrcwe3-3256156.pdf; ComponentLink2Description: https://datasheet.ciiva.com/3256/dcrcwe3-3256156.pdf; ComponentLink3URL: https://datasheet.ciiva.com/7777/1697337-7777211.pdf; ComponentLink3Description: https://datasheet.ciiva.com/7777/1697337-7777211.pdf; ComponentLink4URL: https://datasheet.ciiva.com/16436/dcrcwe3-16436187.pdf; ComponentLink4Description: https://datasheet.ciiva.com/16436/dcrcwe3-16436187.pdf; ComponentLink5URL: https://datasheet.ciiva.com/8336/dcrcwe3-8336654.pdf; ComponentLink5Description: https://datasheet.ciiva.com/8336/dcrcwe3-8336654.pdf; ComponentLink6URL: https://datasheet.ciiva.com/5551/dcrcwe3-109170-5551310.pdf; ComponentLink6Description: https://datasheet.ciiva.com/5551/dcrcwe3-109170-5551310.pdf; ComponentLink7URL: https://datasheet.ciiva.com/22704/1697337-22704428.pdf; ComponentLink7Description: https://datasheet.ciiva.com/22704/1697337-22704428.pdf; ComponentLink8URL: https://datasheet.ciiva.com/2463/dcrcwe3-2463270.pdf; ComponentLink8Description: https://datasheet.ciiva.com/2463/dcrcwe3-2463270.pdf; ComponentLink9URL: https://datasheet.ciiva.com/2463/dcrcwe3-2463269.pdf; ComponentLink9Description: https://datasheet.ciiva.com/2463/dcrcwe3-2463269.pdf; ComponentLink10URL: https://datasheet.ciiva.com/2463/dcrcwe3-2463268.pdf; ComponentLink10Description: https://datasheet.ciiva.com/2463/dcrcwe3-2463268.pdf; ComponentLink11URL: https://datasheet.ciiva.com/16881/dcrcwe3-16881079.pdf; ComponentLink11Description: https://datasheet.ciiva.com/16881/dcrcwe3-16881079.pdf; ComponentLink12URL: https://datasheet.ciiva.com/7777/1697337-7777210.pdf; ComponentLink12Description: https://datasheet.ciiva.com/7777/1697337-7777210.pdf; ComponentLink13URL: https://datasheet.ciiva.com/16777/70201119-16777273.pdf; ComponentLink13Description: https://datasheet.ciiva.com/16777/70201119-16777273.pdf; ComponentLink14URL: https://datasheet.ciiva.com/26316/fld-crcw-e3-data-en-26316647.pdf; ComponentLink14Description: https://datasheet.ciiva.com/26316/fld-crcw-e3-data-en-26316647.pdf; Supplier Part Number 1: 2140783
U1-U8 = SW - SIP32431DR3-T1GE3: Power Load Switch, Reverse Blocking, High Side, Active High, Active Low, 1 Output, 5.5V, 1A; Opis / Description: SIP32431DR3-T1GE3; Value: SIP32431DR3-T1GE3; Velikost / Size: SC70-6; ComponentLink1Description: DataSheet; ComponentLink1URL: D:\altium\Altium_Library\Active\Datasheet\SIP32431DR3.pdf; Supplier 1: Farnell; Supplier Part Number 1: 2361509
U19 = V_LIN - NCP1117STAT3G: LDO Voltage Regulator, Adjustable, 3.5V to 20V in, 1.07V drop, 1.25V to 18.8V/1A out, SOT-223-3; Manufacturer: ON SEMICONDUCTOR; Topology: Buck (Step Down); Input Voltage Min: 4.5; Input Voltage Max: 45; No. of Outputs: 1; DC / DC Converter IC Case: TO-263; No. of Pins: 5; Output Current: 3; Output Voltage Min: 1.23; Output Voltage Max: 37; Switching Frequency: 150; SVHC: No SVHC (12-Jan-2017; Manufacturer Part Number: NCP1117STAT3G; RoHS: YES; Stock 1: 342; Pricing 1: 1=1.98, 10=1.49, 100=1.19, 500=1.04, 1000=0.859, 2500=0.785 (GBP); Operating Temperature Max: 125; Packaging: Each; Product Range: -; Automotive Qualification Standard: -; MSL: MSL 1 - Unlimited; Supplier 1: Farnell; Supplier Part Number 1: 1703381